# EAGLE design Actuator-VK (EAGLE 9.6.2)

## Sheet 1 of 2: Part Schematics
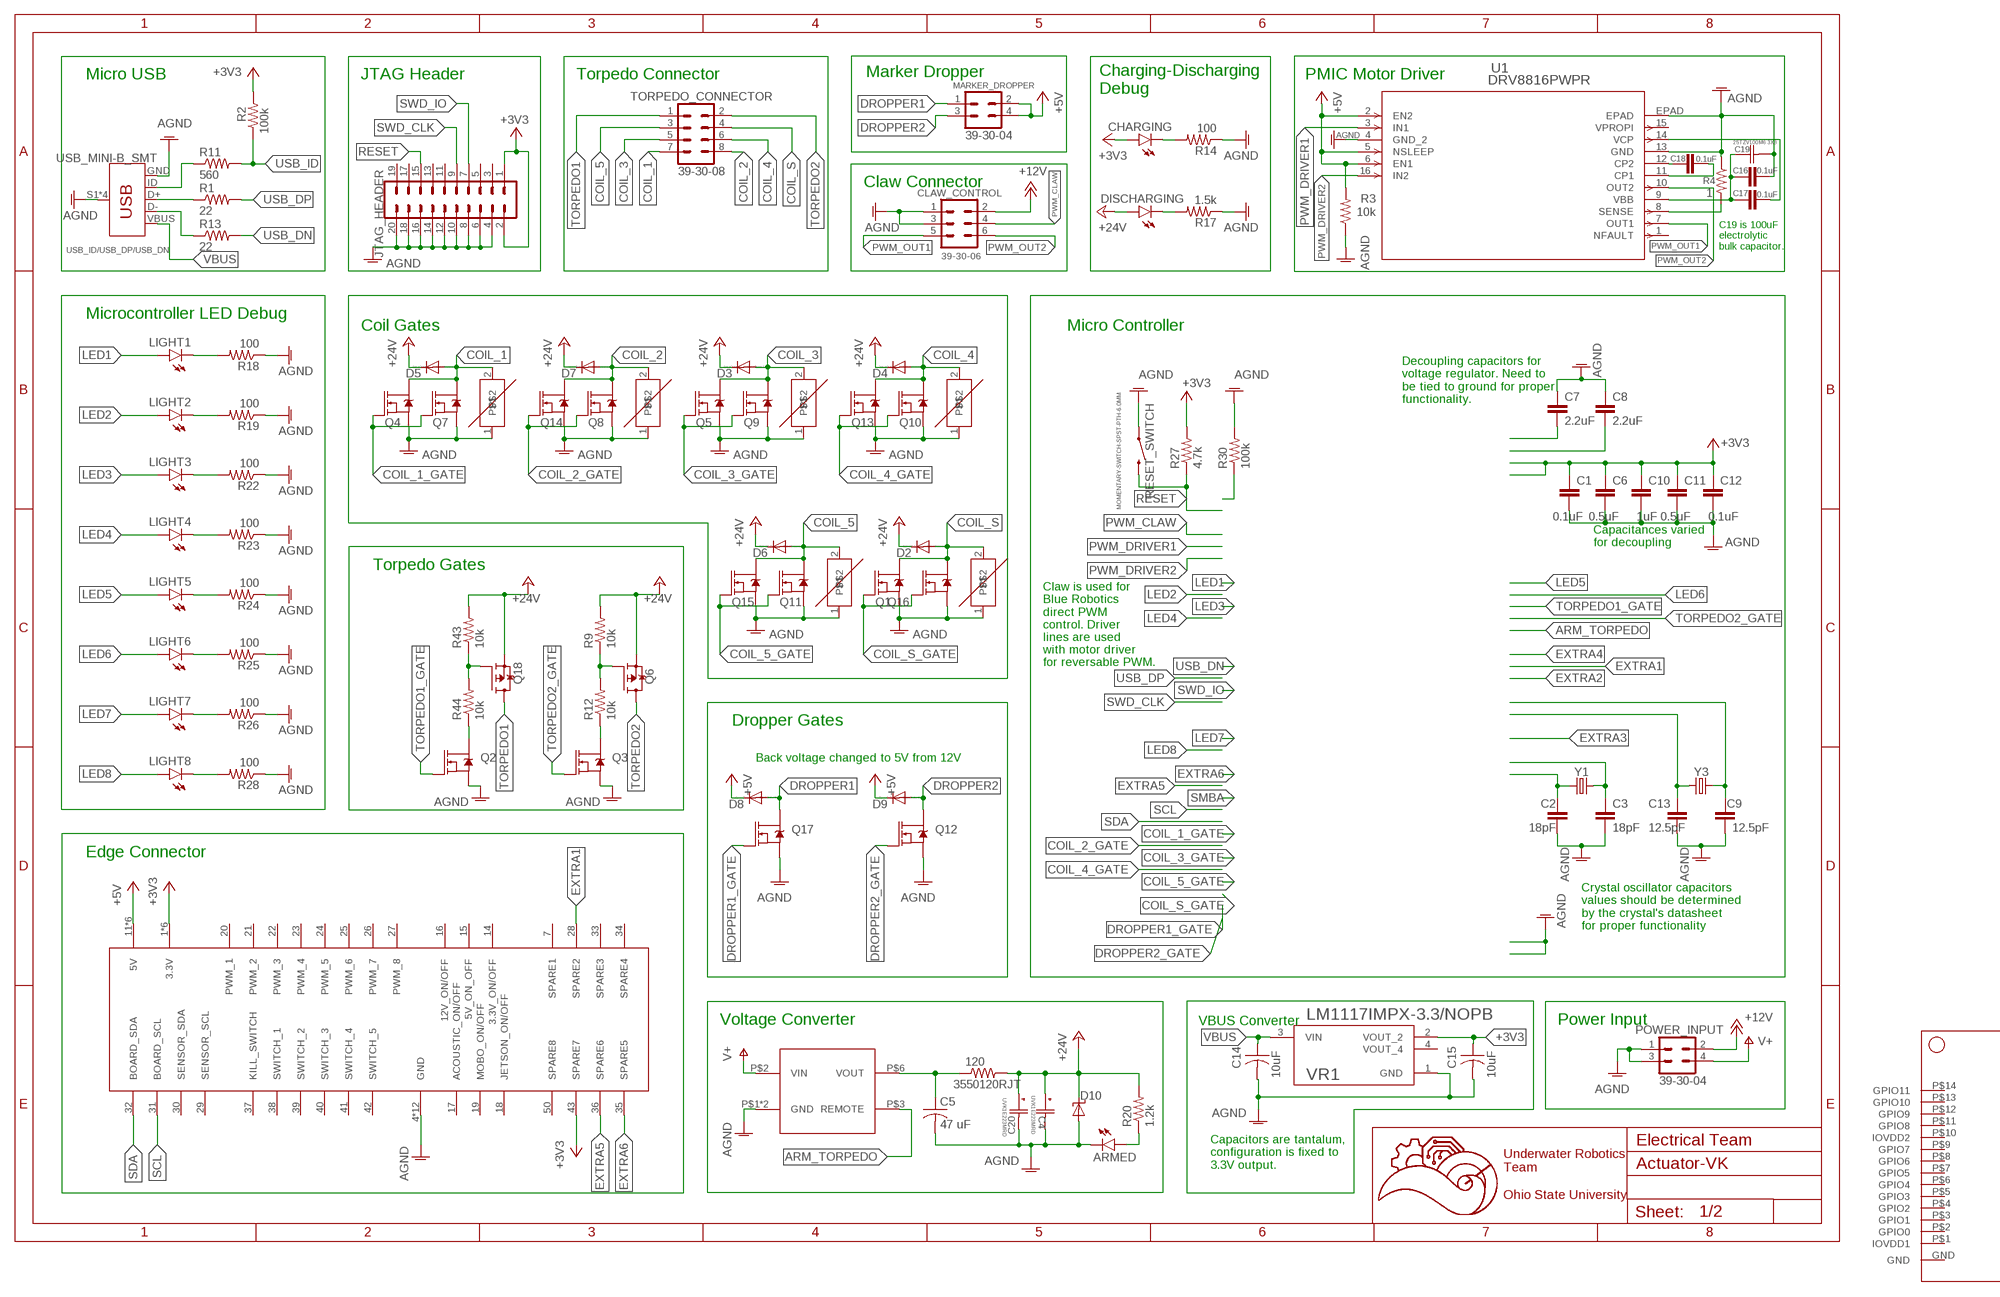
[diagram p0: schematic, sheet 1, part 1 of 2]
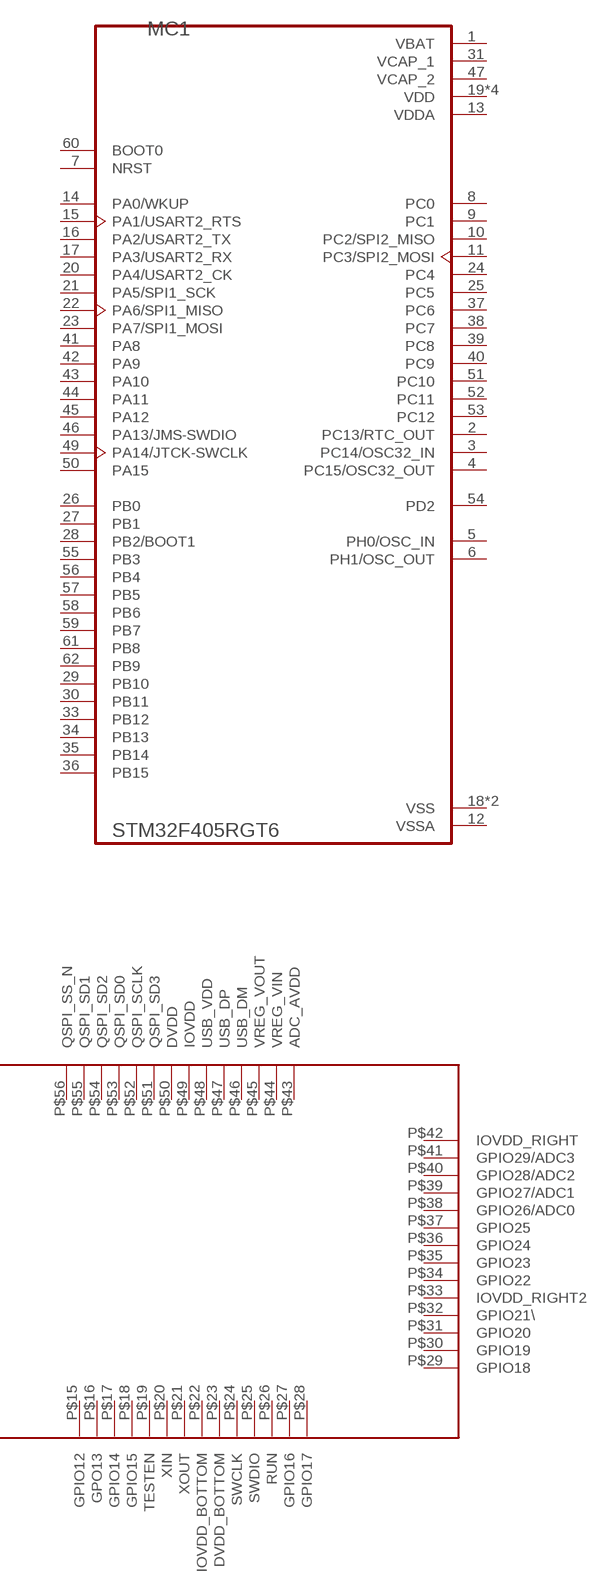
[diagram p1: schematic, sheet 1, part 2 of 2]

### Parts
120  3550120RJT  [3550120RJT]
ARMED  LEDCHIPLED_0603  [CHIPLED_0603]
C1  0.1uF  C-EUC0603  [C0603]
C2  18pF  C-EUC0603  [C0603]
C3  18pF  C-EUC0603  [C0603]
C4  UVK1E223MRD  [CAP_UFW_25X50_NCH]
C5  47 uF  C-USC1206K  [C1206K]
C6  0.5uF  C-EUC0603  [C0603]
C7  2.2uF  C-EUC0603  [C0603]
C8  2.2uF  C-EUC0603  [C0603]
C9  12.5pF  C-EUC0603  [C0603]
C10  1uF  C-EUC0603  [C0603]
C11  0.5uF  C-EUC0603  [C0603]
C12  0.1uF  C-EUC0603  [C0603]
C13  12.5pF  C-EUC0603  [C0603]
C14  10uF  C-USC0603  [C0603]
C15  10uF  C-USC0603  [C0603]
C16  0.1uF  C-EUC0603  [C0603]
C17  0.1uF  C-EUC0603  [C0603]
C18  0.1uF  C-EUC0603  [C0603]
C19  25TZV100M6.3X8  [CAP_J-V_6P3X8_RUB]
C20  UVK1E223MRD  [CAP_UFW_25X50_NCH]
CHARGING  LEDCHIPLED_0603  [CHIPLED_0603]
CLAW_CONTROL  39-30-06  [39-30-?06?]
D2  DIODE-SMB  [SMB]
D3  DIODE-SMB  [SMB]
D4  DIODE-SMB  [SMB]
D5  DIODE-SMB  [SMB]
D6  DIODE-SMB  [SMB]
D7  DIODE-SMB  [SMB]
D8  DIODE-SMB  [SMB]
D9  DIODE-SMB  [SMB]
D10  SUPPRESSOR-SMBJ  [SMBJ]
DISCHARGING  LEDCHIPLED_0603  [CHIPLED_0603]
JTAG_HEADER  CONN_10X2  [2X10]
LIGHT1  LEDCHIPLED_0603  [CHIPLED_0603]
LIGHT2  LEDCHIPLED_0603  [CHIPLED_0603]
LIGHT3  LEDCHIPLED_0603  [CHIPLED_0603]
LIGHT4  LEDCHIPLED_0603  [CHIPLED_0603]
LIGHT5  LEDCHIPLED_0603  [CHIPLED_0603]
LIGHT6  LEDCHIPLED_0603  [CHIPLED_0603]
LIGHT7  LEDCHIPLED_0603  [CHIPLED_0603]
LIGHT8  LEDCHIPLED_0603  [CHIPLED_0603]
MARKER_DROPPER  39-30-04  [39-30-?04?]
MC1  STM32F405RGT6  [QFP50P1200X1200X160-64N]
POWER_INPUT  39-30-04  [39-30-?04?]
Q1  MOSFET-NCH-AO3404A  [SOT23-3]
Q2  MOSFET-NCH-AO3404A  [SOT23-3]
Q3  MOSFET-NCH-AO3404A  [SOT23-3]
Q4  MOSFET-NCH-AO3404A  [SOT23-3]
Q5  MOSFET-NCH-AO3404A  [SOT23-3]
Q6  FDD4141TO252  [TO252]
Q7  MOSFET-NCH-AO3404A  [SOT23-3]
Q8  MOSFET-NCH-AO3404A  [SOT23-3]
Q9  MOSFET-NCH-AO3404A  [SOT23-3]
Q10  MOSFET-NCH-AO3404A  [SOT23-3]
Q11  MOSFET-NCH-AO3404A  [SOT23-3]
Q12  MOSFET-NCH-AO3404A  [SOT23-3]
Q13  MOSFET-NCH-AO3404A  [SOT23-3]
Q14  MOSFET-NCH-AO3404A  [SOT23-3]
Q15  MOSFET-NCH-AO3404A  [SOT23-3]
Q16  MOSFET-NCH-AO3404A  [SOT23-3]
Q17  MOSFET-NCH-AO3404A  [SOT23-3]
Q18  FDD4141TO252  [TO252]
R1  22  R-US_R0603  [R0603]
R2  100k  R-US_R0603  [R0603]
R3  10k  R-US_R0603  [R0603]
R4  1  R-US_R0805  [R0805]
R9  10k  R-US_R0603  [R0603]
R11  560  R-US_R0603  [R0603]
R12  10k  R-US_R0603  [R0603]
R13  22  R-US_R0603  [R0603]
R14  100  R-US_R0805  [R0805]
R17  1.5k  R-US_R0805  [R0805]
R18  100  R-US_R0805  [R0805]
R19  100  R-US_R0805  [R0805]
R20  1.2k  R-US_R0805  [R0805]
R22  100  R-US_R0805  [R0805]
R23  100  R-US_R0805  [R0805]
R24  100  R-US_R0805  [R0805]
R25  100  R-US_R0805  [R0805]
R26  100  R-US_R0805  [R0805]
R27  4.7k  R-US_R0603  [R0603]
R28  100  R-US_R0805  [R0805]
R30  100k  R-US_R0603  [R0603]
R43  10k  R-US_R0603  [R0603]
R44  10k  R-US_R0603  [R0603]
RESET_SWITCH  MOMENTARY-SWITCH-SPST-PTH-6.0MM  [TACTILE_SWITCH_PTH_6.0MM]
TORPEDO_CONNECTOR  39-30-08  [39-30-?08?]
U1  DRV8816PWPR  [PWP_16]
U$1  5530843-EDGE  [5530843-6-BOARDFINGERS]
U$2  ERZ-VF2M270ERZ-VF2M270  [RESM8060X320N]
U$3  ERZ-VF2M270ERZ-VF2M270  [RESM8060X320N]
U$4  ERZ-VF2M270ERZ-VF2M270  [RESM8060X320N]
U$5  ERZ-VF2M270ERZ-VF2M270  [RESM8060X320N]
U$6  TMR6-2415  [TMR6-2415]
U$7  ERZ-VF2M270ERZ-VF2M270  [RESM8060X320N]
U$8  ERZ-VF2M270ERZ-VF2M270  [RESM8060X320N]
U$9  RP2040  [RP2040]
USB_ID/USB_DP/USB_DN  USB_MINI-B_SMT  [USB-MINIB]
VR1  LM1117IMPX-3.3/NOPB  [VREG_LM1117IMPX-3.3/NOPB]
Y1  16MHz  CRYSTAL-16MHZPTH-HC49US  [HC49US]
Y3  32.768kHz  CRYSTAL-32.768KHZSMD-3.2X1.5  [CRYSTAL-SMD-3.2X1.5MM]

### Nets
+3V3: C1.1 C6.1 C10.1 C11.1 C12.1 C15.1 CHARGING.A JTAG_HEADER.1 JTAG_HEADER.2 R2.2 R27.2 U$1.1(3.3V) U$1.2(3.3V) U$1.3(3.3V) U$1.43(SPARE7) U$1.54(3.3V) U$1.55(3.3V) U$1.56(3.3V) VR1.2(VOUT_2)
+5V: D8.C D9.C MARKER_DROPPER.2 MARKER_DROPPER.4 R3.2 U1.2(EN2) U1.5(NSLEEP) U1.6(EN1) U$1.11(5V) U$1.12(5V) U$1.13(5V) U$1.44(5V) U$1.45(5V) U$1.46(5V)
+12V: CLAW_CONTROL.2 POWER_INPUT.2
+24V: 120.P$2 C4.1 C20.1 D2.C D3.C D4.C D5.C D6.C D7.C D10.C DISCHARGING.A Q6.2(S) Q18.2(S) R9.2 R20.2 R43.2
AGND: ARMED.C C1.2 C2.2 C3.2 C4.2 C5.2 C6.2 C7.1 C8.1 C9.2 C10.2 C11.2 C12.2 C13.2 C14.2 C15.2 C16.2 C19.2 C20.2 CLAW_CONTROL.1 CLAW_CONTROL.3 D10.A JTAG_HEADER.4 JTAG_HEADER.6 JTAG_HEADER.8 JTAG_HEADER.10 JTAG_HEADER.12 JTAG_HEADER.14 JTAG_HEADER.16 JTAG_HEADER.18 JTAG_HEADER.20 POWER_INPUT.1 POWER_INPUT.3 Q1.2(S) Q2.2(S) Q3.2(S) Q4.2(S) Q5.2(S) Q7.2(S) Q8.2(S) Q9.2(S) Q10.2(S) Q11.2(S) Q12.2(S) Q13.2(S) Q14.2(S) Q15.2(S) Q16.2(S) Q17.2(S) R3.1 R4.1 R14.1 R17.1 R18.1 R19.1 R22.1 R23.1 R24.1 R25.1 R26.1 R28.1 R30.2 RESET_SWITCH.1 U1.4(GND_2) U1.13(GND) U1.EPAD U$1.4(GND) U$1.5(GND) U$1.6(GND) U$1.8(GND) U$1.9(GND) U$1.10(GND) U$1.47(GND) U$1.48(GND) U$1.49(GND) U$1.51(GND) U$1.52(GND) U$1.53(GND) U$2.1 U$3.1 U$4.1 U$5.1 U$6.P$1(GND) U$6.P$7(GND) U$7.1 U$8.1 USB_ID/USB_DP/USB_DN.GND USB_ID/USB_DP/USB_DN.S1(SHIELD) USB_ID/USB_DP/USB_DN.S2(SHIELD) USB_ID/USB_DP/USB_DN.S3(SHIELD) USB_ID/USB_DP/USB_DN.S4(SHIELD) VR1.1(GND)
ARM_TORPEDO: U$6.P$3(REMOTE)
COIL_1: D5.A Q4.3(D) Q7.3(D) TORPEDO_CONNECTOR.7 U$8.2
COIL_1_GATE: Q4.1(G) Q7.1(G)
COIL_2: D7.A Q8.3(D) Q14.3(D) TORPEDO_CONNECTOR.8 U$7.2
COIL_2_GATE: Q8.1(G) Q14.1(G)
COIL_3: D3.A Q5.3(D) Q9.3(D) TORPEDO_CONNECTOR.5 U$5.2
COIL_3_GATE: Q5.1(G) Q9.1(G)
COIL_4: D4.A Q10.3(D) Q13.3(D) TORPEDO_CONNECTOR.6 U$4.2
COIL_4_GATE: Q10.1(G) Q13.1(G)
COIL_5: D6.A Q11.3(D) Q15.3(D) TORPEDO_CONNECTOR.3 U$3.2
COIL_5_GATE: Q11.1(G) Q15.1(G)
COIL_S: D2.A Q1.3(D) Q16.3(D) TORPEDO_CONNECTOR.4 U$2.2
COIL_S_GATE: Q1.1(G) Q16.1(G)
DROPPER1: D8.A MARKER_DROPPER.1 Q17.3(D)
DROPPER1_GATE: Q17.1(G)
DROPPER2: D9.A MARKER_DROPPER.3 Q12.3(D)
DROPPER2_GATE: Q12.1(G)
EXTRA1: U$1.28(SPARE2)
EXTRA5: U$1.36(SPARE6)
EXTRA6: U$1.35(SPARE5)
LED1: LIGHT1.A
LED2: LIGHT2.A
LED3: LIGHT3.A
LED4: LIGHT4.A
LED5: LIGHT5.A
LED6: LIGHT6.A
LED7: LIGHT7.A
LED8: LIGHT8.A
N$2: C2.1 Y1.1
N$3: C3.1 Y1.2
N$4: CHARGING.C R14.2
N$5: C8.2
N$6: R11.1 USB_ID/USB_DP/USB_DN.ID
N$7: R1.1 USB_ID/USB_DP/USB_DN.D+
N$8: R13.1 USB_ID/USB_DP/USB_DN.D-
N$10: ARMED.A R20.1
N$11: C7.2
N$12: C13.1 Y3.P$2
N$15: DISCHARGING.C R17.2
N$16: LIGHT1.C R18.2
N$17: LIGHT2.C R19.2
N$18: LIGHT3.C R22.2
N$19: LIGHT4.C R23.2
N$21: LIGHT5.C R24.2
N$22: LIGHT6.C R25.2
N$23: LIGHT7.C R26.2
N$24: LIGHT8.C R28.2
N$26: 120.P$1 C5.1 U$6.P$6(VOUT)
N$29: C9.1 Y3.P$1
N$30: R30.1
N$33: Q18.1(G) R43.1 R44.2
N$34: Q2.3(D) R44.1
N$35: Q6.1(G) R9.1 R12.2
N$36: Q3.3(D) R12.1
N$45: R4.2 U1.8(SENSE)
N$46: C17.2 U1.14(VCP)
N$47: C16.1 C17.1 C19.1 U1.9(VBB)
N$48: C18.2 U1.11(CP1)
N$49: C18.1 U1.12(CP2)
PWM_CLAW: CLAW_CONTROL.4
PWM_DRIVER1: U1.3(IN1)
PWM_DRIVER2: U1.16(IN2)
PWM_OUT1: CLAW_CONTROL.5 U1.7(OUT1)
PWM_OUT2: CLAW_CONTROL.6 U1.10(OUT2)
RESET: JTAG_HEADER.15 R27.1 RESET_SWITCH.3
SCL: U$1.31(BOARD_SCL)
SDA: U$1.32(BOARD_SDA)
SWD_CLK: JTAG_HEADER.9
SWD_IO: JTAG_HEADER.7
TORPEDO1: Q18.3(D) TORPEDO_CONNECTOR.1
TORPEDO1_GATE: Q2.1(G)
TORPEDO2: Q6.3(D) TORPEDO_CONNECTOR.2
TORPEDO2_GATE: Q3.1(G)
USB_DN: R13.2
USB_DP: R1.2
USB_ID: R2.1 R11.2
V+: POWER_INPUT.4 U$6.P$2(VIN)
VBUS: C14.1 USB_ID/USB_DP/USB_DN.VBUS VR1.3(VIN)
Unconnected: JTAG_HEADER.3 JTAG_HEADER.5 JTAG_HEADER.11 JTAG_HEADER.13 JTAG_HEADER.17 JTAG_HEADER.19 MC1.2(PC13/RTC_OUT) MC1.3(PC14/OSC32_IN) MC1.4(PC15/OSC32_OUT) MC1.5(PH0/OSC_IN) MC1.6(PH1/OSC_OUT) MC1.7(NRST) MC1.8(PC0) MC1.9(PC1) MC1.10(PC2/SPI2_MISO) MC1.11(PC3/SPI2_MOSI) MC1.14(PA0/WKUP) MC1.15(PA1/USART2_RTS) MC1.16(PA2/USART2_TX) MC1.17(PA3/USART2_RX) MC1.20(PA4/USART2_CK) MC1.21(PA5/SPI1_SCK) MC1.22(PA6/SPI1_MISO) MC1.23(PA7/SPI1_MOSI) MC1.24(PC4) MC1.25(PC5) MC1.26(PB0) MC1.27(PB1) MC1.28(PB2/BOOT1) MC1.29(PB10) MC1.30(PB11) MC1.33(PB12) MC1.34(PB13) MC1.35(PB14) MC1.36(PB15) MC1.37(PC6) MC1.38(PC7) MC1.39(PC8) MC1.40(PC9) MC1.41(PA8) MC1.42(PA9) MC1.43(PA10) MC1.44(PA11) MC1.45(PA12) MC1.46(PA13/JMS-SWDIO) MC1.49(PA14/JTCK-SWCLK) MC1.50(PA15) MC1.51(PC10) MC1.52(PC11) MC1.53(PC12) MC1.54(PD2) MC1.55(PB3) MC1.56(PB4) MC1.57(PB5) MC1.58(PB6) MC1.59(PB7) MC1.60(BOOT0) MC1.61(PB8) MC1.62(PB9) U1.1(NFAULT) U1.15(VPROPI) U$1.7(SPARE1) U$1.14(3.3V_ON/OFF) U$1.15(5V_ON_OFF) U$1.16(12V_ON/OFF) U$1.17(ACOUSTIC_ON/OFF) U$1.18(JETSON_ON/OFF) U$1.19(MOBO_ON/OFF) U$1.20(PWM_1) U$1.21(PWM_2) U$1.22(PWM_3) U$1.23(PWM_4) U$1.24(PWM_5) U$1.25(PWM_6) U$1.26(PWM_7) U$1.27(PWM_8) U$1.29(SENSOR_SCL) U$1.30(SENSOR_SDA) U$1.33(SPARE3) U$1.34(SPARE4) U$1.37(KILL_SWITCH) U$1.38(SWITCH_1) U$1.39(SWITCH_2) U$1.40(SWITCH_3) U$1.41(SWITCH_4) U$1.42(SWITCH_5) U$1.50(SPARE8) U$9.GND U$9.P$1(IOVDD1) U$9.P$2(GPIO0) U$9.P$3(GPIO1) U$9.P$4(GPIO2) U$9.P$5(GPIO3) U$9.P$6(GPIO4) U$9.P$7(GPIO5) U$9.P$8(GPIO6) U$9.P$9(GPIO7) U$9.P$10(IOVDD2) U$9.P$11(GPIO8) U$9.P$12(GPIO9) U$9.P$13(GPIO10) U$9.P$14(GPIO11) U$9.P$15(GPIO12) U$9.P$16(GPO13) U$9.P$17(GPIO14) U$9.P$18(GPIO15) U$9.P$19(TESTEN) U$9.P$20(XIN) U$9.P$21(XOUT) U$9.P$22(IOVDD_BOTTOM) U$9.P$23(DVDD_BOTTOM) U$9.P$24(SWCLK) U$9.P$25(SWDIO) U$9.P$26(RUN) U$9.P$27(GPIO16) U$9.P$28(GPIO17) U$9.P$29(GPIO18) U$9.P$30(GPIO19) U$9.P$31(GPIO20) U$9.P$32(GPIO21\) U$9.P$33(IOVDD_RIGHT2) U$9.P$34(GPIO22) U$9.P$35(GPIO23) U$9.P$36(GPIO24) U$9.P$37(GPIO25) U$9.P$38(GPIO26/ADC0) U$9.P$39(GPIO27/ADC1) U$9.P$40(GPIO28/ADC2) U$9.P$41(GPIO29/ADC3) U$9.P$42(IOVDD_RIGHT) U$9.P$43(ADC_AVDD) U$9.P$44(VREG_VIN) U$9.P$45(VREG_VOUT) U$9.P$46(USB_DM) U$9.P$47(USB_DP) U$9.P$48(USB_VDD) U$9.P$49(IOVDD) U$9.P$50(DVDD) U$9.P$51(QSPI_SD3) U$9.P$52(QSPI_SCLK) U$9.P$53(QSPI_SD0) U$9.P$54(QSPI_SD2) U$9.P$55(QSPI_SD1) U$9.P$56(QSPI_SS_N) VR1.4(VOUT_4)

### Notes on the sheet
- Micro USB | JTAG Header | Torpedo Connector | Marker Dropper | PMIC Motor Driver
- Charging-Discharging 
  Debug
- Claw Connector
- C19 is 100uF
  electrolytic
  bulk capacitor.
- Microcontroller LED Debug
- Coil Gates | Micro Controller
- Decoupling capacitors for 
  voltage regulator. Need to
  be tied to ground for proper
  functionality.
- Capacitances varied 
  for decoupling
- Torpedo Gates
- Claw is used for
  Blue Robotics
  direct PWM
  control. Driver
  lines are used
  with motor driver
  for reversable PWM.
- Dropper Gates
- Back voltage changed to 5V from 12V
- Edge Connector
- Crystal oscillator capacitors
  values should be determined
  by the crystal's datasheet
  for proper functionality
- Voltage Converter | VBUS Converter | Power Input
- Electrical Team
- Capacitors are tantalum, 
  configuration is fixed to 
  3.3V output.
- Underwater Robotics
  Team
  
  Ohio State University

## Sheet 2 of 2: Notes
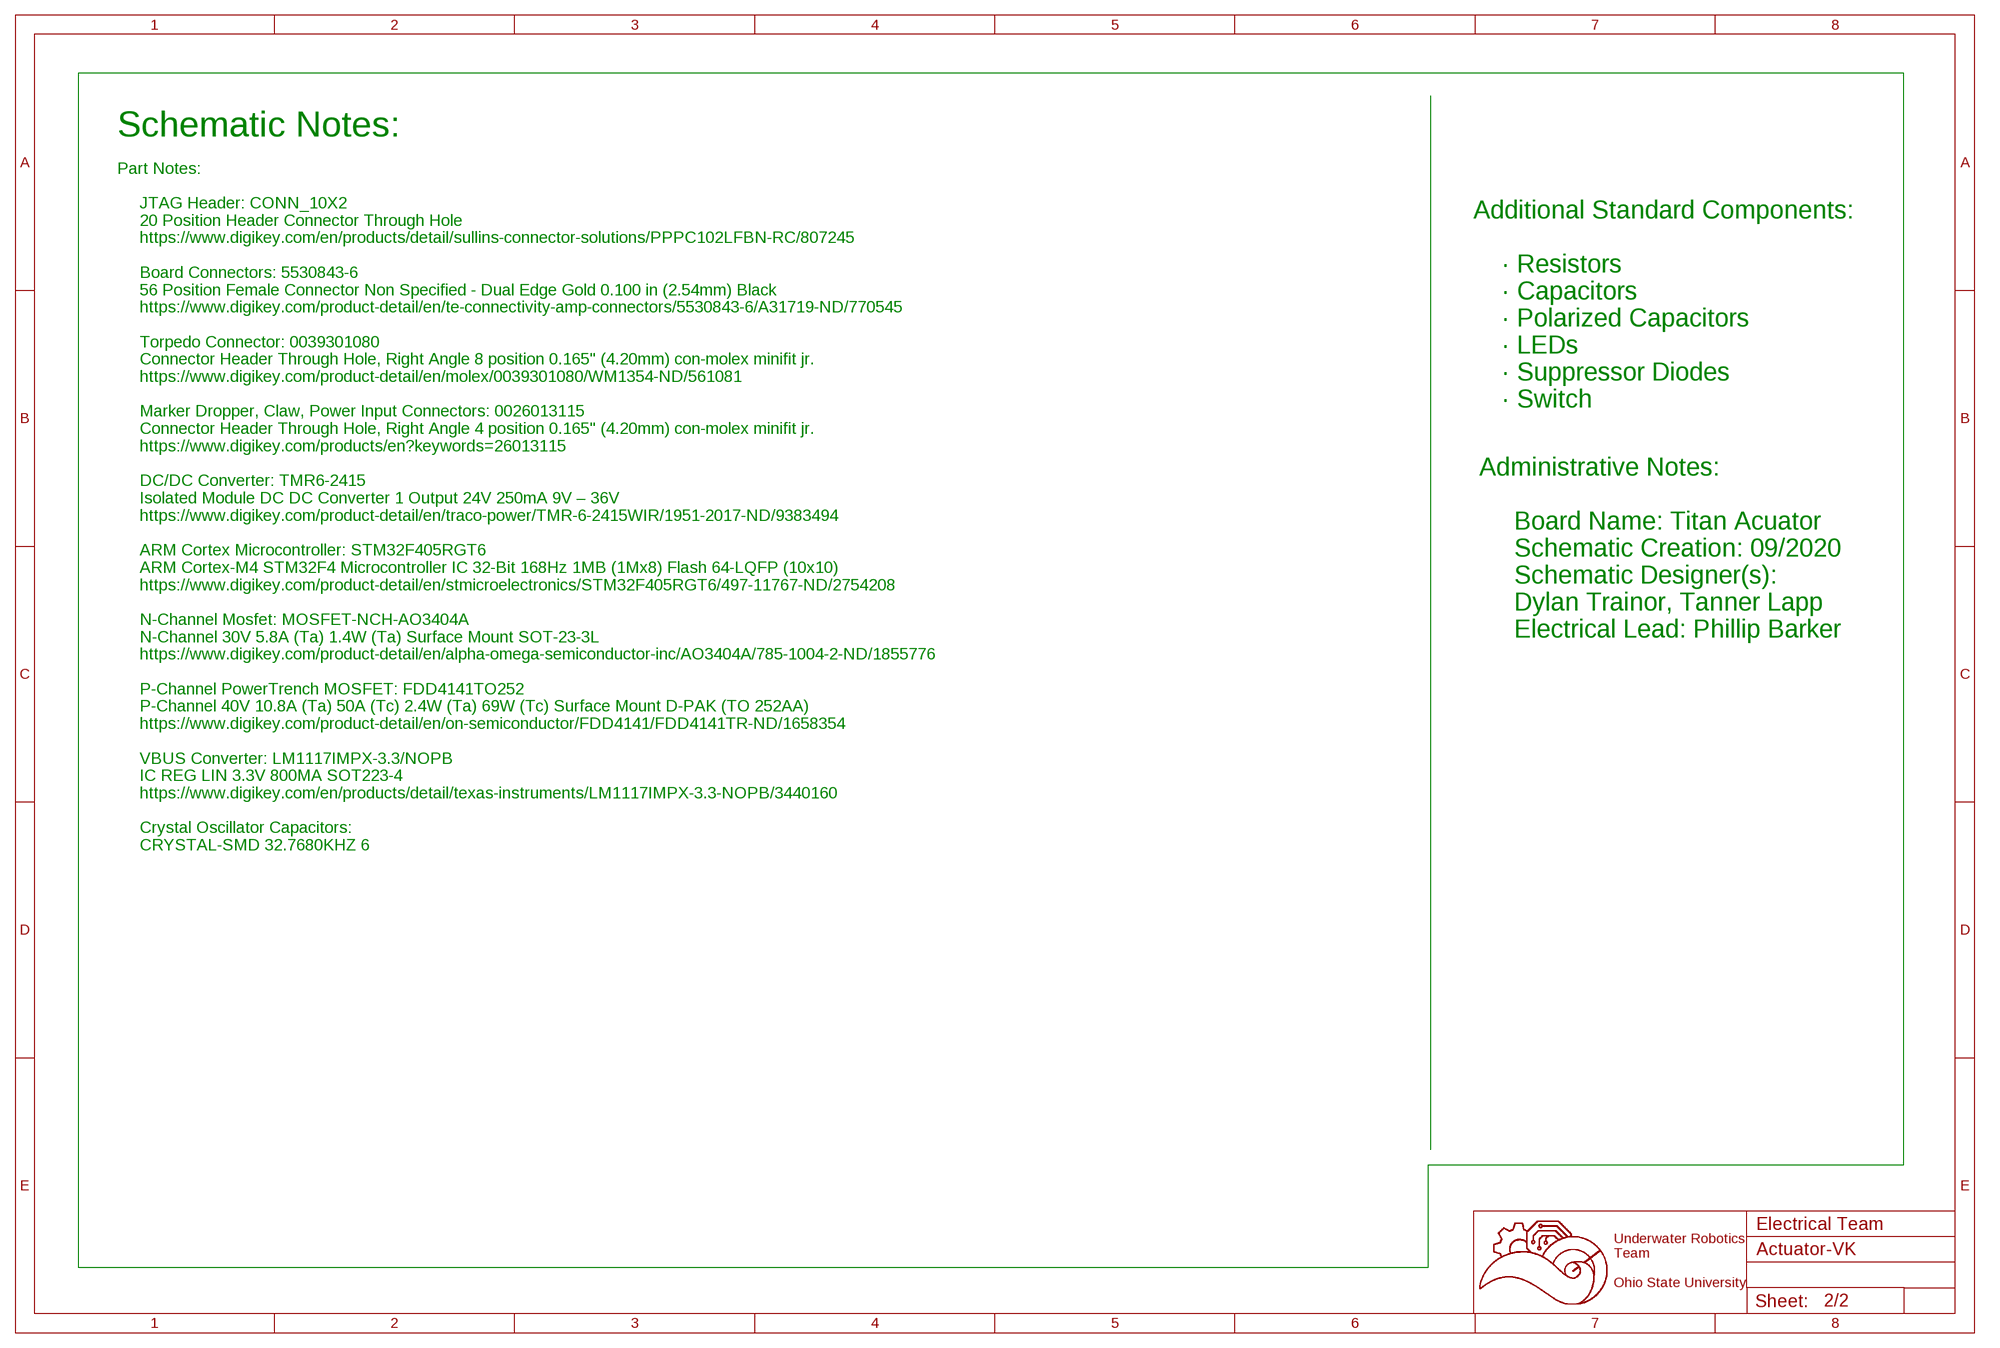
[diagram p2: schematic, sheet 2]

### Notes on the sheet
- Schematic Notes:
- Part Notes:
  
       JTAG Header: CONN_10X2
       20 Position Header Connector Through Hole 
       https://www.digikey.com/en/products/detail/sullins-connector-solutions/PPPC102LFBN-RC/807245
    
       Board Connectors: 5530843-6 
       56 Position Female Connector Non Specified - Dual Edge Gold 0.100 in (2.54mm) Black 
       https://www.digikey.com/product-detail/en/te-connectivity-amp-connectors/5530843-6/A31719-ND/770545 
    
       Torpedo Connector: 0039301080 
       Connector Header Through Hole, Right Angle 8 position 0.165" (4.20mm) con-molex minifit jr. 
       https://www.digikey.com/product-detail/en/molex/0039301080/WM1354-ND/561081 
    
       Marker Dropper, Claw, Power Input Connectors: 0026013115 
       Connector Header Through Hole, Right Angle 4 position 0.165" (4.20mm) con-molex minifit jr. 
       https://www.digikey.com/products/en?keywords=26013115 
    
       DC/DC Converter: TMR6-2415 
       Isolated Module DC DC Converter 1 Output 24V 250mA 9V – 36V 
       https://www.digikey.com/product-detail/en/traco-power/TMR-6-2415WIR/1951-2017-ND/9383494 
    
       ARM Cortex Microcontroller: STM32F405RGT6 
       ARM Cortex-M4 STM32F4 Microcontroller IC 32-Bit 168Hz 1MB (1Mx8) Flash 64-LQFP (10x10) 
       https://www.digikey.com/product-detail/en/stmicroelectronics/STM32F405RGT6/497-11767-ND/2754208 
    
       N-Channel Mosfet: MOSFET-NCH-AO3404A 
       N-Channel 30V 5.8A (Ta) 1.4W (Ta) Surface Mount SOT-23-3L 
       https://www.digikey.com/product-detail/en/alpha-omega-semiconductor-inc/AO3404A/785-1004-2-ND/1855776 
    
       P-Channel PowerTrench MOSFET: FDD4141TO252 
       P-Channel 40V 10.8A (Ta) 50A (Tc) 2.4W (Ta) 69W (Tc) Surface Mount D-PAK (TO 252AA) 
       https://www.digikey.com/product-detail/en/on-semiconductor/FDD4141/FDD4141TR-ND/1658354
  
       VBUS Converter: LM1117IMPX-3.3/NOPB
       IC REG LIN 3.3V 800MA SOT223-4
       https://www.digikey.com/en/products/detail/texas-instruments/LM1117IMPX-3.3-NOPB/3440160
    
       Crystal Oscillator Capacitors: 
       CRYSTAL-SMD 32.7680KHZ 6PF  3.2X1.5MM 
       https://www.digikey.com/en/products/detail/micro-crystal-ag/CM7V-T1A-32-768KHZ-6PF-20PPM-TA-QC/10499118
       CRYSTAL-16MHZPTH-HC49US (CRYSTAL-16MHZ)
       https://www.digikey.com/en/products/detail/abracon-llc/ABM3B-16-000MHZ-B2-T/675317?s=N4IgTCBcDaIKwGY4FoCcBGMZnuQOQBEQBdAXyA 
  
       ERZ-VF2M270 Varistor
       VARISTOR 27V 125A 2SMD JLEAD
       https://www.digikey.com/en/products/detail/panasonic-electronic-components/ERZ-VF2M270/672899
  
       3550120RJT Resistor
       RES 3550 120 Ohm 5% 5W
       https://www.digikey.com/en/products/detail/te-connectivity-passive-product/3550120RJT/9927251
  
       DRV8816PWPR Motor Driver
       IC MOTOR DRIVER 8V-38V 16HTSSOP
       https://www.digikey.com/en/products/detail/texas-instruments/DRV8816PWPR/4439658
  
       25TZV100M6.3X8 Electrolytic Capacitor
       CAP ALUM 100UF 20% 25V SMD
       https://www.digikey.com/en/products/detail/rubycon/25TZV100M6-3X8/3134865
  
       UVK1E223MRD 22mF Capacitor
       CAP ALUM 22000UF 20% 25V RADIAL
       https://www.digikey.com/en/products/detail/nichicon/UVK1E223MRD/2539394
- Additional Standard Components:
  
       · Resistors 
       · Capacitors 
       · Polarized Capacitors 
       · LEDs 
       · Suppressor Diodes 
       · Switch
- Administrative Notes:
  
       Board Name: Titan Acuator
       Schematic Creation: 09/2020
       Schematic Designer(s): 
       Dylan Trainor, Tanner Lapp
       Electrical Lead: Phillip Barker
- Electrical Team
- Underwater Robotics
  Team
  
  Ohio State University

## Power pins joined to a net without a drawn wire
VBAT: MC1.1(VBAT)
VCAP_1: MC1.31(VCAP_1)
VCAP_2: MC1.47(VCAP_2)
VDD: MC1.19(VDD) MC1.32(VDD) MC1.48(VDD) MC1.64(VDD)
VDDA: MC1.13(VDDA)
VSS: MC1.18(VSS) MC1.63(VSS)
VSSA: MC1.12(VSSA)

## Library data of the parts
120 = 3550120RJT:3550120RJT
ARMED CHARGING DISCHARGING LIGHT1-LIGHT8 = led:LED: LED OSRAM: - CHIPLED LG R971, LG N971, LY N971, LG Q971, LY Q971, LO R971, LY R971 LH N974, LH R974 LS Q976, LO Q976, LY Q976 LO Q996 - Hyper CHIPLED LW Q18S LB Q993, LB Q99A, LB R99A - SideLED LS A670, LO A670, LY A670, LG A670, LP A670 LB A673, LV A673, LT A673, LW A673 LH A674 LY A675 LS A676, LA A676, LO A676, LY A676, LW A676 LS A679, LY A679, LG A679 - Hyper Micro SIDELED® LS Y876, LA Y876, LO Y876, LY Y876 LT Y87S - SmartLED LW L88C, LW L88S LB L89C, LB L89S, LG L890 LS L89K, LO L89K, LY L89K LS L896, LA L896, LO L896, LY L896 - TOPLED LS T670, LO T670, LY T670, LG T670, LP T670 LSG T670, LSP T670, LSY T670, LOP T670, LYG T670 LG T671, LOG T671, LSG T671 LB T673, LV T673, LT T673, LW T673 LH T674 LS T676, LA T676, LO T676, LY T676, LB T676, LH T676, LSB T676, LW T676 LB T67C, LV T67C, LT T67C, LS T67K, LO T67K, LY T67K, LW E67C LS E67B, LA E67B, LO E67B, LY E67B, LB E67C, LV E67C, LT E67C LW T67C LS T679, LY T679, LG T679 LS T770, LO T770, LY T770, LG T770, LP T770 LB T773, LV T773, LT T773, LW T773 LH T774 LS E675, LA E675, LY E675, LS T675 LS T776, LA T776, LO T776, LY T776, LB T776 LHGB T686 LT T68C, LB T68C - Hyper Mini TOPLED® LB M676 - Mini TOPLED Santana® LG M470 LS M47K, LO M47K, LY M47K Source: http://www.osram.convergy.de LUXEON: - LUMILED® LXK2-PW12-R00, LXK2-PW12-S00, LXK2-PW14-U00, LXK2-PW14-V00 LXK2-PM12-R00, LXK2-PM12-S00, LXK2-PM14-U00 LXK2-PE12-Q00, LXK2-PE12-R00, LXK2-PE12-S00, LXK2-PE14-T00, LXK2-PE14-U00 LXK2-PB12-K00, LXK2-PB12-L00, LXK2-PB12-M00, LXK2-PB14-N00, LXK2-PB14-P00, LXK2-PB14-Q00 LXK2-PR12-L00, LXK2-PR12-M00, LXK2-PR14-Q00, LXK2-PR14-R00 LXK2-PD12-Q00, LXK2-PD12-R00, LXK2-PD12-S00 LXK2-PH12-R00, LXK2-PH12-S00 LXK2-PL12-P00, LXK2-PL12-Q00, LXK2-PL12-R00 Source: www.luxeon.com KINGBRIGHT: KA-3528ASYC Source: www.kingbright.com
C1-C3 C6-C13 C16-C18 = rcl:C-EU: CAPACITOR, European symbol; SPICEPREFIX: C
C4 C20 = UVK1E223MRD:UVK1E223MRD; BUILT_BY: EMA_Cory; COPYRIGHT: Copyright (C) 2018 Accelerated Designs. All rights reserved; MANUFACTURER_PART_NUMBER: UVK1E223MRD; SOURCELIBRARY: Nichicon_2019-09-13; VENDOR: Nichicon
C5 = resistor:C-US: CAPACITOR, American symbol
C14 C15 = rcl:C-US: CAPACITOR, American symbol; SPICEPREFIX: C
C19 = 25TZV100M6_3X8:25TZV100M6.3X8; BUILT_BY: EMA_Cory; COPYRIGHT: Copyright (C) 2018 Accelerated Designs. All rights reserved; MANUFACTURER_PART_NUMBER: 25TZV100M6.3X8; SOURCELIBRARY: Rubycon_2019-09-19; VENDOR: Rubycon Netherlands
CLAW_CONTROL = con-molex-mini-fit:39-30-?06?: HEADER
D2-D9 = diode:DIODE-: DIODE
D10 = diode:SUPPRESSOR-: Suppressor diode
JTAG_HEADER = SparkFun-Connectors:CONN_10X2: Multi connection point. Often used as Generic Header-pin footprint for 0.1 inch spaced/style header connections On any of the 0.1 inch spaced packages, you can populate with these: Break Away Headers - Straight <https://www.sparkfun.com/products/116> (PRT-00116) Break Away Male Headers - Right Angle <https://www.sparkfun.com/products/553> (PRT-00553) Female Headers <https://www.sparkfun.com/products/115> (PRT-00115) Break Away Headers - Machine Pin <https://www.sparkfun.com/products/117> (PRT-00117) Break Away Female Headers - Swiss Machine Pin <https://www.sparkfun.com/products/743> (PRT-00743) Special note about the "SPECIAL" package: This was SPECIALLY designed to be used with our Graphic LCD Backpack. Be sure you want to use this! It is not only staggered on each line of header holes, but IT IS ALSO offset of the center point of the top and bottom lines by 5 mil. This causes the headers to lock into place on the "standard" footprint on the LCD screen. The extra squares on the tdocu layer are there simply to reference other pins (if you were to actually populate a longer header than ten long - this is what we do with the backpacks).
MARKER_DROPPER POWER_INPUT = con-molex-mini-fit:39-30-?04?: HEADER
MC1 = STM32F405RGT6:STM32F405RGT6: High-performance foundation line, ARM Cortex-M4 core with DSP and FPU, 1 Mbyte Flash, 168 MHz CPU, ART Accelerator; AVAILABILITY: Unavailable; DESCRIPTION: High-performance foundation line, ARM Cortex-M4 core with DSP and FPU, 1 Mbyte Flash, 168 MHz CPU, ART Accelerator; MF: STMicroelectronics; MP: STM32F405RGT6; PACKAGE: LQFP-64 STMicroelectronics; PRICE: None
Q1-Q5 Q7-Q17 = SparkFun-DiscreteSemi:MOSFET-NCH: N-channel MOSFETs Voltage controlled devices that allow control of high current outputs. SparkFun Products: SparkFun OpenScale <https://www.sparkfun.com/products/13261> SparkFun Digital Sandbox <https://www.sparkfun.com/products/12651> SparkFun Monster Moto Shield <https://www.sparkfun.com/products/10182> SparkFun MOSFET Power Controller <https://www.sparkfun.com/products/11214>; PROD_ID: TRANS-12988; VALUE: 5.8A/30V/35mΩ
Q6 Q18 = transistor-fet:FDD4141: P-Channel PowerTrench® MOSFET Source: FDD4141.pdf
R1 R2 R11 R13 R27 R30 = rcl:R-US_: RESISTOR, American symbol; SPICEPREFIX: R
R3 R4 R9 R12 R14 R17-R20 R22-R26 R28 R43 R44 = resistor:R-US_: RESISTOR, American symbol
RESET_SWITCH = SparkFun-Switches:MOMENTARY-SWITCH-SPST: Momentary Switch (Pushbutton) - SPST Normally-open (NO) SPST momentary switches (buttons, pushbuttons). Variants PTH-12MM - 12mm square, through-hole Momentary Pushbutton Switch - 12mm Square <https://www.sparkfun.com/products/9190> (COM-09190) PTH-6.0MM, PTH-6.0MM-KIT - 6.0mm square, through-hole Mini Pushbutton Switch <https://www.sparkfun.com/products/97> (COM-00097) KIT package intended for soldering kit's - only one side of pads' copper is exposed. PTH-RIGHT-ANGLE-KIT - Right-angle, through-hole Right Angle Tactile Button <https://www.sparkfun.com/products/10791> - Used on SparkFun BigTime Watch Kit <https://www.sparkfun.com/products/11734> SMD-12MM - 12mm square, surface-mount Tactile Button - SMD (12mm) <https://www.sparkfun.com/products/12993> (COM-12993) Used on SparkFun PicoBoard <https://www.sparkfun.com/products/11888> SMD-4.5MM - 4.5mm Square Trackball Switch Used on SparkFun Blackberry Trackballer Breakout <https://www.sparkfun.com/products/13169> SMD-4.6MMX2.8MM - 4.60mm x 2.80mm, surface mount Used on SparkFun SAMD21 Mini Breakout <https://www.sparkfun.com/products/13664> SMD-5.2MM, SMD-5.2-REDUNDANT - 5.2mm square, surface-mount Mini Pushbutton Switch - SMD <https://www.sparkfun.com/products/8720> (COM-08720) Used on Arduino Pro Mini <https://www.sparkfun.com/products/11114> REDUNDANT package connects both switch circuits together SMD-6.0X3.5MM - 6.0 x 3.5mm, surface mount Momentary Reset Switch SMD <https://www.sparkfun.com/products/8229> (COM-08229) SMD-6.2MM-TALL - 6.2mm square, surface mount Tactile Button - SMD (6mm) <https://www.sparkfun.com/products/12992> Used on SparkFun Digital Sandbox <https://www.sparkfun.com/products/12651> SMD-RIGHT-ANGLE - Right-angle, surface mount Used on SparkFun Block for Intel® Edison - Arduino <https://www.sparkfun.com/products/13036>; PROD_ID: SWCH-08441; SF_SKU: COM-00097
TORPEDO_CONNECTOR = con-molex-mini-fit:39-30-?08?: HEADER
U1 = DRV8816POWPR:DRV8816PWPR; MANUFACTURER_PART_NUMBER: DRV8816PWPR; VENDOR: Texas Instruments
U$1 = 5530843-6:5530843-EDGE
U$2-U$5 U$7 U$8 = ERZ-VF2M270:ERZ-VF2M270
U$6 = converter:TMR6-2415
U$9 = rp2040:RP2040
USB_ID/USB_DP/USB_DN = SparkFun-Connectors:USB_MINI-B: USB type Mini-B Connector Breaks out 5th pin, and includes shield pins if needed. SparkFun Products: SparkFun FTDI Basic Breakout <https://www.sparkfun.com/products/9716> SparkFun XBee Explorer USB <https://www.sparkfun.com/products/11812> SparkFun Redboard <https://www.sparkfun.com/products/12757>; PROD_ID: CONN-08193; SF_ID: PRT-00587
VR1 = LM1117IMPX-3.3_NOPB:LM1117IMPX-3.3/NOPB: 800-mA 15-V linear voltage regulator 4-SOT-223 0 to 125 Check prices <https://pricing.snapeda.com/parts/LM1117IMPX-3.3/NOPB/Texas%20Instruments/view-part?ref=eda>; AVAILABILITY: Good; DESCRIPTION: 800-mA 15-V linear voltage regulator 4-SOT-223 -40 to 125; MF: Texas Instruments; MP: LM1117IMPX-3.3/NOPB; PACKAGE: SOT-223-4 Texas Instruments; PRICE: None; PURCHASE-URL: https://pricing.snapeda.com/search/part/LM1117IMPX-3.3/NOPB/?ref=eda
Y1 = SparkFun-Clocks:CRYSTAL-16MHZ: 16MHz Crystal Digikey Example <http://www.digikey.com/product-search/en?keywords=535-9122-1-ND> Frequency: 16MHz Frequency Stability: ±50ppm Frequency Tolerance: ±20ppm Load Capacitance: 18pF SparkFun Products: Pro Micro -5V/16MHz <https://www.sparkfun.com/products/12640> SparkFun Serial Enabled LCD Kit <https://www.sparkfun.com/products/10097>; PROD_ID: XTAL-08181; SF_ID: COM-00536
Y3 = SparkFun-Clocks:CRYSTAL-32.768KHZ: 32.768kHz Crystal Frequency: 32.768kHz Frequency Stability: ±20ppm Load Capacitance: 12.5pF (PTH-2X6 & SMD-3.2X1.5), 6pF (SMD-2X6) SparkFun Products: SparkFun BigTime Watch Kit <https://www.sparkfun.com/products/11734> SparkFun nRF52832 Breakout <https://www.sparkfun.com/products/13990> SparkFun Real Time Clock Module <https://www.sparkfun.com/products/12708>; PROD_ID: XTAL-13062

## Board
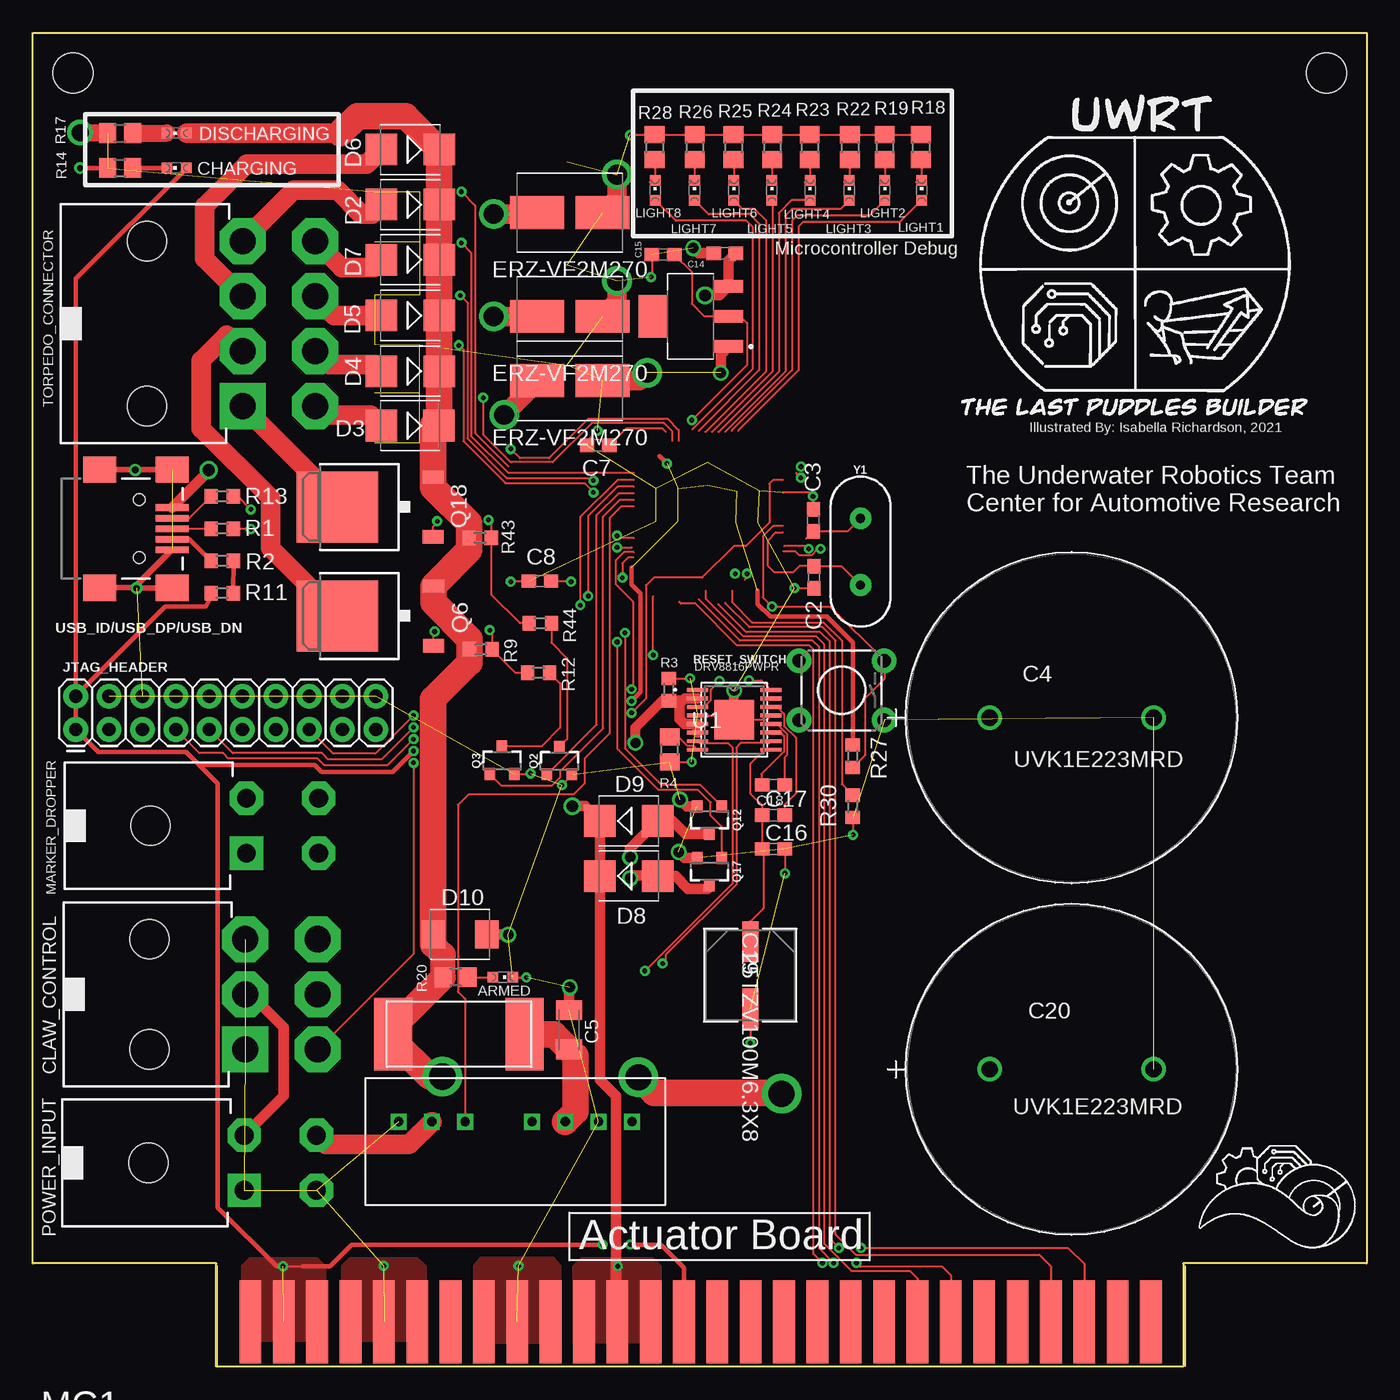
[diagram p3: board, top side]
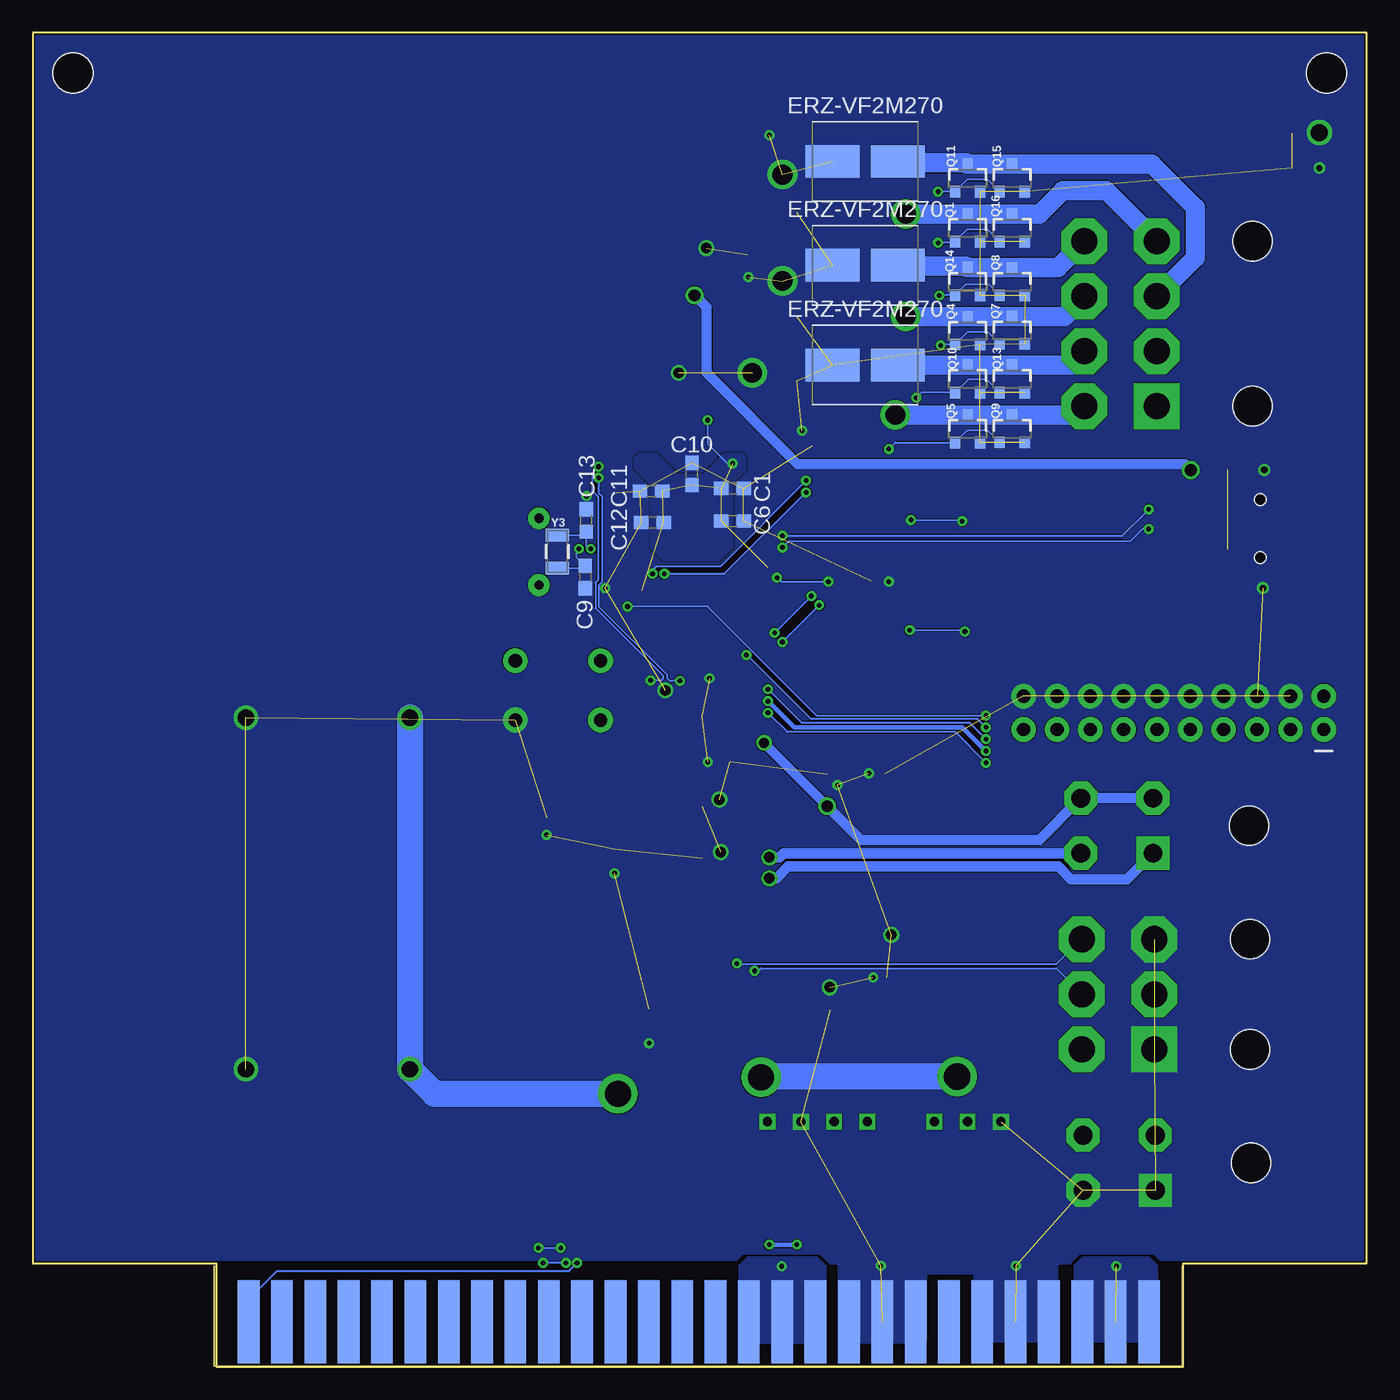
[diagram p4: board, bottom side, seen from below]

Size 101.6 x 101.6 mm. Coordinates in mm from the lower left corner, seen from the top.
Outline: 13.97,0 13.97,7.87 0,7.87 0,101.6 101.6,101.6 101.6,7.87 87.63,7.87 87.63,0 13.97,0
Copper layers (1*16): Top 0.035mm / dielectric 1.5mm / Bottom 0.035mm
Design rules "default *": minimum track width 6mil, minimum drill 0.35mm, track to track 2mil, track to pad 2mil, pad to pad 2mil, via to via 2mil, smd to smd 2mil, copper to edge 0mil, drill to drill 6mil, minimum pad ring 10mil, minimum via ring 8mil, stop-mask expansion 4mil, vias tented up to drill 0mil, thermal gap 10mil
Holes 3.05 mm at 3.05,98.55 98.55,98.55

### Footprints (pad centres in the part's own frame; a part is rotated, then mirrored left to right if it is on the bottom)
3550120RJT = smd 2.896 x 5.499: P$1 -5,0; P$2 5,0
CHIPLED_0603 = smd 0.8 x 0.8: A 0,-0.75; C 0,0.75
C0603 = smd 1.1 x 1: 1 -0.85,0; 2 0.85,0
CAP_UFW_25X50_NCH = drill 1.245 pad 1.753: 1 0,0; 2 12.497,0
C1206K = smd 1.5 x 2: 1 -1.5,0; 2 1.5,0
CAP_J-V_6P3X8_RUB = smd 3.099 x 1.219: 1 -2.553,0; 2 2.553,0
39-30-?06? = drill 2 pad 3.5 square: 1 4.191,0 | drill 2 pad 3.5 octagon: 2 0,0; 3 -4.191,0; 4 4.191,5.512; 5 0,5.512; 6 -4.191,5.512 | hole 3: -4.191,-7.3; 4.191,-7.3
SMB = smd 2.4 x 2.4: A 2.2,0; C -2.2,0
SMBJ = smd 1.78 x 2.16: A 2.04,0; C -2.03,0
2X10 = drill 1.016 pad 1.88: 1 0,0; 2 0,2.54; 3 2.54,0; 4 2.54,2.54; 5 5.08,0; 6 5.08,2.54; 7 7.62,0; 8 7.62,2.54; 9 10.16,0; 10 10.16,2.54; 11 12.7,0; 12 12.7,2.54; 13 15.24,0; 14 15.24,2.54; 15 17.78,0; 16 17.78,2.54; 17 20.32,0; 18 20.32,2.54; 19 22.86,0; 20 22.86,2.54
39-30-?04? = drill 1.422 pad 2.54 square: 1 2.095,0 | drill 1.422 pad 2.54 octagon: 2 -2.095,0; 3 2.095,5.512; 4 -2.095,5.512 | hole 3: 0,-7.3
QFP50P1200X1200X160-64N = smd 1.47 x 0.28: 1 -5.67,3.75; 2 -5.67,3.25; 3 -5.67,2.75; 4 -5.67,2.25; 5 -5.67,1.75; 6 -5.67,1.25; 7 -5.67,0.75; 8 -5.67,0.25; 9 -5.67,-0.25; 10 -5.67,-0.75; 11 -5.67,-1.25; 12 -5.67,-1.75; 13 -5.67,-2.25; 14 -5.67,-2.75; 15 -5.67,-3.25; 16 -5.67,-3.75; 33 5.67,-3.75; 34 5.67,-3.25; 35 5.67,-2.75; 36 5.67,-2.25; 37 5.67,-1.75; 38 5.67,-1.25; 39 5.67,-0.75; 40 5.67,-0.25; 41 5.67,0.25; 42 5.67,0.75; 43 5.67,1.25; 44 5.67,1.75; 45 5.67,2.25; 46 5.67,2.75; 47 5.67,3.25; 48 5.67,3.75 | smd 0.28 x 1.47: 17 -3.75,-5.67; 18 -3.25,-5.67; 19 -2.75,-5.67; 20 -2.25,-5.67; 21 -1.75,-5.67; 22 -1.25,-5.67; 23 -0.75,-5.67; 24 -0.25,-5.67; 25 0.25,-5.67; 26 0.75,-5.67; 27 1.25,-5.67; 28 1.75,-5.67; 29 2.25,-5.67; 30 2.75,-5.67; 31 3.25,-5.67; 32 3.75,-5.67; 49 3.75,5.67; 50 3.25,5.67; 51 2.75,5.67; 52 2.25,5.67; 53 1.75,5.67; 54 1.25,5.67; 55 0.75,5.67; 56 0.25,5.67; 57 -0.25,5.67; 58 -0.75,5.67; 59 -1.25,5.67; 60 -1.75,5.67; 61 -2.25,5.67; 62 -2.75,5.67; 63 -3.25,5.67; 64 -3.75,5.67
SOT23-3 = smd 0.8 x 0.9: 1 -0.95,-1; 2 0.95,-1; 3 0,1.1
TO252 = smd 1 x 1.6: 1 -2.28,-4.8; 2 2.28,-4.8 | smd 5.4 x 6.2: 3 0,2.5
R0603 = smd 1 x 1.1: 1 -0.85,0; 2 0.85,0
R0805 = smd 1.3 x 1.5: 1 -0.95,0; 2 0.95,0
TACTILE_SWITCH_PTH_6.0MM = drill 1.016 pad 1.88: 1 -3.251,2.261; 2 3.251,2.261; 3 -3.251,-2.261; 4 3.251,-2.261
39-30-?08? = drill 2 pad 3.5 square: 1 6.287,0 | drill 2 pad 3.5 octagon: 2 2.095,0; 3 -2.095,0; 4 -6.287,0; 5 6.287,5.512; 6 2.095,5.512; 7 -2.095,5.512; 8 -6.287,5.512 | hole 3: -6.287,-7.3; 6.287,-7.3
PWP_16 = smd 1.6 x 0.3: 1 -2.8,2.275; 2 -2.8,1.625; 3 -2.8,0.975; 4 -2.8,0.325; 5 -2.8,-0.325; 6 -2.8,-0.975; 7 -2.8,-1.625; 8 -2.8,-2.275; 9 2.8,-2.275; 10 2.8,-1.625; 11 2.8,-0.975; 12 2.8,-0.325; 13 2.8,0.325; 14 2.8,0.975; 15 2.8,1.625; 16 2.8,2.275 | smd 3 x 3: EPAD 0,0
5530843-6-BOARDFINGERS = smd 1.651 x 6.35 bottom: 1 0.826,3.375; 2 3.365,3.375; 3 5.905,3.375; 4 8.445,3.375; 5 10.986,3.375; 6 13.525,3.375; 7 16.066,3.375; 8 18.605,3.375; 9 21.145,3.375; 10 23.686,3.375; 11 26.226,3.375; 12 28.765,3.375; 13 31.305,3.375; 14 33.846,3.375; 15 36.386,3.375; 16 38.925,3.375; 17 41.465,3.375; 18 44.005,3.375; 19 46.545,3.375; 20 49.086,3.375; 21 51.626,3.375; 22 54.166,3.375; 23 56.706,3.375; 24 59.245,3.375; 25 61.785,3.375; 26 64.326,3.375; 27 66.865,3.375; 28 69.406,3.375 | smd 1.651 x 6.35: 29 69.406,3.375; 30 66.865,3.375; 31 64.326,3.375; 32 61.785,3.375; 33 59.245,3.375; 34 56.706,3.375; 35 54.166,3.375; 36 51.626,3.375; 37 49.086,3.375; 38 46.545,3.375; 39 44.005,3.375; 40 41.465,3.375; 41 38.925,3.375; 42 36.386,3.375; 43 33.846,3.375; 44 31.305,3.375; 45 28.765,3.375; 46 26.226,3.375; 47 23.686,3.375; 48 21.145,3.375; 49 18.605,3.375; 50 16.066,3.375; 51 13.525,3.375; 52 10.986,3.375; 53 8.445,3.375; 54 5.905,3.375; 55 3.365,3.375; 56 0.826,3.375
RESM8060X320N = smd 4.11 x 2.5: 1 -2.495,0; 2 2.495,0
TMR6-2415 = drill 0.7 square: P$1 0,0; P$2 2.54,0; P$3 5.08,0; P$5 10.16,0; P$6 12.7,0; P$7 15.24,0; P$8 17.78,0
RP2040 = smd 3.2 x 3.2: GND 0,0 | smd 1 x 0.2: P$1 -3.5,2.6; P$2 -3.5,2.2; P$3 -3.5,1.8; P$4 -3.5,1.4; P$5 -3.5,1; P$6 -3.5,0.6; P$7 -3.5,0.2; P$8 -3.5,-0.2; P$9 -3.5,-0.6; P$10 -3.5,-1; P$11 -3.5,-1.4; P$12 -3.5,-1.8; P$13 -3.5,-2.2; P$14 -3.5,-2.6; P$29 3.5,-2.6; P$30 3.5,-2.2; P$31 3.5,-1.8; P$32 3.5,-1.4; P$33 3.5,-1; P$34 3.5,-0.6; P$35 3.5,-0.2; P$36 3.5,0.2; P$37 3.5,0.6; P$38 3.5,1; P$39 3.5,1.4; P$40 3.5,1.8; P$41 3.5,2.2; P$42 3.5,2.6 | smd 0.2 x 1: P$15 -2.6,-3.5; P$16 -2.2,-3.5; P$17 -1.8,-3.5; P$18 -1.4,-3.5; P$19 -1,-3.5; P$20 -0.6,-3.5; P$21 -0.2,-3.5; P$22 0.2,-3.5; P$23 0.6,-3.5; P$24 1,-3.5; P$25 1.4,-3.5; P$26 1.8,-3.5; P$27 2.2,-3.5; P$28 2.6,-3.5; P$43 2.6,3.5; P$44 2.2,3.5; P$45 1.8,3.5; P$46 1.4,3.5; P$47 1,3.5; P$48 0.6,3.5; P$49 0.2,3.5; P$50 -0.2,3.5; P$51 -0.6,3.5; P$52 -1,3.5; P$53 -1.4,3.5; P$54 -1.8,3.5; P$55 -2.2,3.5; P$56 -2.6,3.5
USB-MINIB = smd 2.5 x 0.5: D+ 2.5,0; D- 2.5,0.8; GND 2.5,-1.6; ID 2.5,-0.8; VBUS 2.5,1.6 | smd 2.5 x 2: S1 -3,4.5; S2 2.5,4.5; S3 -3,-4.5; S4 2.5,-4.5 | hole 0.9: 0,2.2; 0,-2.2
VREG_LM1117IMPX-3.3/NOPB = smd 2.15 x 0.95: 1 -2.9,2.3; 2 -2.9,0; 3 -2.9,-2.3 | smd 2.15 x 3.25: 4 2.9,0
HC49US = drill 0.7 pad 1.651: 1 -2.54,0; 2 2.54,0
CRYSTAL-SMD-3.2X1.5MM = smd 1 x 1.8: P$1 -1.25,0; P$2 1.25,0

### Placement (x,y rotation side)
120  32.46,25.33 180 top
ARMED  35.81,29.66 270 top
C1  48.3,66.9 0 bottom
C2  59.49,60.13 270 top
C3  59.45,64.47 90 top
C4  72.88,49.43 0 top
C5  40.85,25.67 90 top
C6  48.3,64.4 0 bottom
C7  43.07,70.17 0 top
C8  38.62,59.84 0 top
C9  59.51,60.14 270 bottom
C10  51.4,68 90 bottom
C11  54.5,66.7 180 bottom
C12  54.4,64.3 180 bottom
C13  59.45,64.46 90 bottom
C14  52.7,84.8 180 top
C15  48,84.7 180 top
C16  56.41,39.43 0 top
C17  56.41,42 0 top
C18  56.41,44.31 180 top
C19  54.65,29.82 270 top
C20  72.88,22.65 0 top
CHARGING  10.95,91.31 90 top
CLAW_CONTROL  39-30-06?  [39-30-?06?]  16.18,28.36 270 top
D2  28.76,88.51 180 top
D3  28.74,71.68 180 top
D4  28.76,75.82 180 top
D5  28.75,80.08 180 top
D6  28.76,92.71 180 top
D7  28.76,84.32 180 top
D8  45.4,37.36 0 top
D9  45.4,41.57 0 top
D10  32.53,32.93 0 top
DISCHARGING  10.95,93.96 90 top
JTAG_HEADER  3.27,48.53 0 top
LIGHT1  67.7,89.6 0 top
LIGHT2  64.9,89.6 0 top
LIGHT3  62.2,89.6 0 top
LIGHT4  59.2,89.6 0 top
LIGHT5  56.3,89.6 0 top
LIGHT6  53.4,89.6 0 top
LIGHT7  50.4,89.6 0 top
LIGHT8  47.4,89.6 0 top
MARKER_DROPPER  39-30-04?  [39-30-?04?]  16.26,41.2 270 top
MC1  8.22,-11.33 0 top  (outside the outline)
POWER_INPUT  39-30-04?  [39-30-?04?]  16.1,15.53 270 top
Q1  30.4,86.7 0 bottom
Q2  40.11,46.12 0 top
Q3  35.74,46.14 0 top
Q4  30.4,78.87 0 bottom
Q5  30.4,71.39 0 bottom
Q6  25.71,57.19 90 top
Q7  27,78.9 0 bottom
Q8  27,82.6 0 bottom
Q9  27,71.4 0 bottom
Q10  30.4,75.2 0 bottom
Q11  30.4,90.5 0 bottom
Q12  51.54,41.68 180 top
Q13  27,75.21 0 bottom
Q14  30.4,82.61 0 bottom
Q15  27,90.5 0 bottom
Q16  27,86.7 0 bottom
Q17  51.54,37.74 180 top
Q18  25.7,65.49 90 top
R1  14.43,63.84 0 top
R2  14.43,58.92 180 top
R3  48.44,51.58 270 top
R4  48.51,47.02 90 top
R9  34.12,54.64 180 top
R11  14.43,61.38 0 top
R12  38.52,52.85 180 top
R13  14.43,66.3 0 top
R14  6.64,91.31 0 top
R17  6.64,93.96 0 top
R18  67.65,92.88 270 top
R19  64.9,92.88 270 top
R20  32.22,29.67 180 top
R22  62.24,92.88 270 top
R23  59.18,92.88 270 top
R24  56.33,92.88 270 top
R25  53.37,92.88 270 top
R26  50.42,92.88 270 top
R27  62.45,46.5 90 top
R28  47.35,92.88 270 top
R30  62.46,42.68 270 top
R43  34.07,63.14 180 top
R44  38.65,56.64 180 top
RESET_SWITCH  61.6,51.51 180 top
TORPEDO_CONNECTOR  39-30-08?  [39-30-?08?]  15.99,79.45 270 top
U1  53.43,49.27 0 top
U$1  15.76,0.05 0 top
U$2  40.9,87.9 180 top
U$3  38.2,91.8 0 bottom
U$4  38.2,76.3 0 bottom
U$5  40.9,75.1 180 top
U$6  27.86,18.66 0 top
U$7  38.2,83.9 0 bottom
U$8  40.9,80 180 top
U$9  4.03,-25.69 0 top  (outside the outline)
USB_ID/USB_DP/USB_DN  8.1,63.84 0 top
VR1  50.1,80 180 top
Y1  63.05,62.08 90 top
Y3  61.66,62.08 90 bottom

### Tracks (layer width: path | path; a pad name or v marks a point on that pad's centre or on a via)
+3V3  (via drill 0.35)  (8 unrouted)
  Top 0.152: 13.58,58.64 R2.2 | U$1.43 49.61,3.44 | C15.1 50.2,83.35 50.2,80.97 51.17,80 VR1.2 53.9,80 54.4,79.5 54.4,76.3 v50.2,72.1 | v19.06,7.65 20.54,7.65
  Top 0.35: v45.6,50.7 46.3,51.4 46.3,58.88 45.61,59.57 45.61,60.87 | v29,46.9 27.4,45.3 22,45.3 21.47,45.83 12.67,45.83 | 12.67,45.83 11.67,46.83 4.97,46.83 JTAG_HEADER.1 JTAG_HEADER.2 | JTAG_HEADER.2 10.1,57.9 13.15,57.9 13.58,58.64 | v19.06,7.65 18.56,7.65 14.09,12.11 14.09,44.41 12.67,45.83 | 49.61,3.44 49.61,7.55 47.87,9.3 v45.5,9.3 | 55.2,59.12 55.2,58.1 56.18,57.12 60.49,57.12 62.45,55.16 R27.2 | 20.54,7.65 22.65,7.65 24.3,9.3 v43.4,9.3 | 47.73,69.37 v48.3,68.8 | JTAG_HEADER.2 3.27,82.87 CHARGING.A
  Bottom 0.152: v50.2,72.1 50.2,70.3 48.7,68.8 v48.3,68.8
  Bottom 0.35: v45.6,50.7 43.6,48.7 30.8,48.7 v29,46.9 | v45.5,9.3 v43.4,9.3
  pour Bottom (no thermals): 15.93,7.67 16.57,8.3 21.65,8.3 22.28,7.67 22.28,1.95 15.93,1.95
  pour Top (no thermals): 15.93,7.67 16.57,8.3 21.65,8.3 22.28,7.67 22.28,1.95 15.93,1.95
  pour Bottom (rank 2, no thermals): 48.3,67.3 48.3,62.4 49.3,61.4 53.6,61.4 54.5,62.3 54.5,67.1 55.8,68.4 55.8,69.2 55.4,69.6 54.1,69.6 52.5,68 50.5,68 48.9,69.6 47.6,69.6 47.3,69.3 47.3,68.3
+5V  (via drill 0.35, 0.77, 0.9)
  Top 0.775: R3.2 47.95,50.73 45.9,48.68 v45.9,47.52
  Top 0.8: U$1.12 44.42,3.52 44.42,20.63 43.2,21.86 D8.C D9.C 42.07,42.7 v41.09,42.7 | U1.2 50.61,50.91 49.67,50.91 49.49,50.73 | R3.2 49.49,50.73 | 49.49,50.73 49.26,50.5 49.26,49.34 49.64,48.96 50.61,48.96 U1.5 U1.6
  Bottom 0.775: v41.09,42.7 45.9,47.5 v45.9,47.52 | v45.9,47.52
  Bottom 0.8: MARKER_DROPPER.2 MARKER_DROPPER.4 24.94,40.13 38.53,40.13 v41.09,42.7
  other vias: 44.56,7.65
  pour Top (no thermals): 41.2,1.83 41.2,7.67 41.84,8.3 47.17,8.3 47.81,7.67 47.81,1.83
  pour Bottom (no thermals): 41.2,1.83 41.2,7.67 41.84,8.3 47.17,8.3 47.81,7.67 47.81,1.83
+12V
  Top 0.8: POWER_INPUT.2 19.09,20.62 19.09,25.85 16.58,28.36 CLAW_CONTROL.2
+24V  (via drill 2)
  Top 1.5: 30.5,71.72 30.98,71.72 D3.C | 30.94,75.8 D4.C | 30.96,80.07 D5.C | D7.C | DISCHARGING.A 23.42,93.96
  Top 1.905: 30.5,32.15 31.27,31.38 R20.2 27.46,25.86 120.P$2 27.46,24.86
  Top 2: 30.5,71.72 Q18.2 30.5,66.97 33.22,64.25 R43.2 33.22,62.18 Q6.2 30.51,58.2 33.27,55.44 R9.2 33.27,53.64 30.5,50.87 D10.C 30.5,32.15 | D3.C 30.94,75.8 | D4.C 30.96,80.07 | D5.C D7.C | D7.C D2.C D6.C 28.41,95.27 24.72,95.27 23.42,93.96 | v57.03,20.79 56.97,20.85 47.32,20.85 v46.13,22.04 | v31.2,22.1 30.22,22.1 27.46,24.86
  Bottom 2: v46.13,22.04 46.07,22.1 v31.2,22.1 | v57.03,20.79 71.01,20.79 C20.1 C4.1 | C4.1
AGND  (via drill 0.35, 0.45, 0.5, 0.77, 0.8, 1.3, 1.5)  (70 unrouted)
  Top 0.152: R18.1 R19.1 R22.1 R23.1 R24.1 R25.1 R26.1 R28.1 47.32,93.8 v45.5,93.8 | 57.15,66.57 59.16,66.57 v59.43,66.3 59.43,65.35 C3.2 | C8.1 37.73,59.8 v36.4,59.8 | v43,71.3 42.22,70.52 C7.1 | Q3.2 37.84,45.14 v37.9,45.2 | Q2.2 41.06,45.06 v40.3,44.3 | 40.85,28.85 v40.9,28.9 | ARMED.C 37.57,29.66 v37.59,29.64 | 36.17,32.93 v36.2,32.9 | C2.2 58.02,59.28 v58,59.3 | C15.2 47.15,83.05 v47.1,83 | R3.1 50.05,52.43 v50.06,52.44 | R4.1 v50.18,46.07 v50.19,46.06 | C16.2 57.29,39.4 v57.29,37.58 | C19.2 v54.65,24.63 | U1.13 55.9,49.27 U1.EPAD 53.1,49.59 U1.4 | R30.2 v62.46,40.53 v62.47,40.52
  Top 0.35: R14.1 v3.61,91.31 v3.6,91.3
  Top 0.4: USB_ID/USB_DP/USB_DN.GND 7.9,59.53 v7.9,59.3
  Top 0.406: USB_ID/USB_DP/USB_DN.S1 7.76,68.34 | 7.76,68.34 v7.8,68.3 | USB_ID/USB_DP/USB_DN.S2 7.76,68.34 | USB_ID/USB_DP/USB_DN.S3 7.86,59.34 v7.9,59.3 10.57,59.3 USB_ID/USB_DP/USB_DN.S4
  Top 0.775: U1.EPAD v53.43,51.51 | v53.43,51.51
  Top 0.8: Q17.2 49.66,38.74 v49.2,39.2 | C5.2 40.85,28.85 | D10.A 36.17,32.93 | Q12.2 49.82,42.68 v49.3,43.2 | C14.2 50.7,84.8 v50.3,85.2 | VR1.1 52.4,77.1 v52.4,75.7
  Top 1.3: R17.1 3.64,93.96 v3.6,94
  Top 1.5: U$2.1 44.5,89 v44.5,90.8 | U$8.1 44.5,81.11 v44.5,82.7 | U$5.1 46.2,75.1 v46.8,75.7
  other vias: 26.73,7.67 37.01,7.67
  pour Top (no thermals): 23.55,7.67 24.19,8.3 29.27,8.3 29.9,7.67 29.9,1.95 23.55,1.95
  pour Bottom (no thermals): 23.55,7.67 24.19,8.3 29.27,8.3 29.9,7.67 29.9,1.95 23.55,1.95
  pour Top (no thermals): 33.71,1.83 40.19,1.83 40.19,7.67 39.68,8.3 34.09,8.3 33.58,7.67 33.58,1.95
  pour Bottom (no thermals): 33.58,7.67 33.58,1.95 33.71,1.83 40.06,1.83 40.06,5.76 40.19,5.89 40.19,7.67 39.68,8.3 34.09,8.3
  pour Bottom (rank 3, no thermals): 0.25,101.35 101.35,101.35 101.35,8.13 48.01,8.13 47.5,8.64 41.66,8.64 40.89,7.87 40.39,7.87 39.62,7.11 24.13,7.11 23.37,7.87 22.61,7.87 21.84,8.64 16.26,8.64 15.75,8.13 0.25,8.13
ARM_TORPEDO
  Top 0.152: 45.77,65.54 44.84,65.54 43.94,64.64 43.94,48.24 42.05,46.35 42.05,44.45 41.2,43.6 33.2,43.6 32.39,42.79 32.39,28.56 32.94,28.02 U$6.P$3
COIL_1  (via drill 1.5)
  Top 1.5: D5.A 22.96,80.08 TORPEDO_CONNECTOR.7 | v35.1,80 U$8.2
  Bottom 1.5: TORPEDO_CONNECTOR.7 23.04,80 Q7.3 27.03,79.97 Q4.3 35.07,79.97 v35.1,80
COIL_1_GATE  (via drill 0.35)
  Top 0.152: v42.7,66.59 42.7,66.61 42.01,67.3 36,67.3 32.8,70.5 32.8,77.45 v32.45,77.8 | v53.5,60.4 53.73,60.17
  Bottom 0.152: v42.7,66.59 v42.71,66.59 48.9,60.4 v53.5,60.4 | Q7.1 28.85,78.8 30.42,78.8 Q4.1 32.38,77.87 v32.45,77.8
COIL_2
  Top 1.5: D7.A 25.96,83.72 23.51,83.72 TORPEDO_CONNECTOR.8
  Bottom 1.5: TORPEDO_CONNECTOR.8 23.53,83.7 Q8.3 Q14.3 30.51,83.82 35.63,83.82 U$7.2
COIL_2_GATE  (via drill 0.35)
  Top 0.152: v42.7,67.5 42.49,67.7 36.1,67.7 33.1,70.7 33.1,81.05 v32.55,81.6 | v54.4,60.4 54.4,60.1 54.23,59.93
  Bottom 0.152: v54.4,60.4 54.4,60.7 54.1,61 49.2,61 v42.7,67.5 | Q8.1 28.75,82.4 30.56,82.4 Q14.1 v32.55,81.6
COIL_3  (via drill 1.5)
  Top 1.5: D3.A 25.74,72.48 22.18,72.48 TORPEDO_CONNECTOR.5 | U$5.2 38.41,75 v35.9,72.5
  Bottom 1.5: TORPEDO_CONNECTOR.5 22.16,72.5 Q9.3 Q5.3 | Q5.3 | Q5.3 v35.9,72.5
COIL_3_GATE  (via drill 0.35)
  Top 0.152: 49.19,70.52 49.19,71.36 48.35,72.2 42.33,72.2 39.33,69.2 37.1,69.2 v36.4,69.9
  Bottom 0.152: Q9.1 28.85,71.3 30.44,71.3 Q5.1 35.91,70.39 v36.4,69.9
COIL_4
  Top 1.5: D4.A 26.06,76.32 22.53,76.32 TORPEDO_CONNECTOR.6
  Bottom 1.5: TORPEDO_CONNECTOR.6 22.54,76.31 Q13.3 Q10.3 U$4.2
COIL_4_GATE  (via drill 0.35)
  Top 0.152: 48.69,70.52 48.69,71.26 48.07,71.88 42.58,71.88 39.6,68.9 36.4,68.9 34.3,71 v34.3,73.8
  Bottom 0.152: Q13.1 28.94,75.2 30.35,75.2 Q10.1 33.9,74.2 v34.3,73.8
COIL_5
  Top 1.5: D6.A 25.44,91.6 16.3,91.6 13.1,88.4 13.1,84.4 15.96,81.54 TORPEDO_CONNECTOR.3
  Bottom 1.5: TORPEDO_CONNECTOR.3 15.97,81.54 13.04,84.48 13.04,88.29 16.35,91.6 Q15.3 Q11.3 30.5,91.7 35.6,91.7 U$3.2
COIL_5_GATE  (via drill 0.35)
  Top 0.152: 36.23,68.57 33.7,71.1 33.7,88.45 v32.65,89.5
  Bottom 0.152: Q15.1 28.85,90.4 30.45,90.4 Q11.1 v32.65,89.5
COIL_S  (via drill 1.5)
  Top 1.5: D2.A 25.85,87.8 25,87.8 23.2,89.6 19.85,89.6 TORPEDO_CONNECTOR.4 | v35.1,87.8 38.3,87.8 U$2.2
  Bottom 1.5: TORPEDO_CONNECTOR.4 19.84,89.58 23.15,89.58 24.94,87.8 Q16.3 Q1.3 v35.1,87.8
COIL_S_GATE  (via drill 0.35)
  Top 0.152: 45.78,68.1 36.2,68.1 33.4,70.9 33.4,84.85 v32.65,85.6
  Bottom 0.152: Q16.1 28.85,86.6 30.45,86.6 Q1.1 31.45,85.6 v32.65,85.6
DROPPER1  (via drill 0.8)
  Top 0.8: Q17.3 51.54,36.54 51.4,36.4 49.9,36.4 48.94,37.36 D8.A 47.56,37.4 45.7,37.4 v45.5,37.2
  Bottom 0.8: v45.5,37.2 44.97,37.2 44.08,38.09 23.49,38.09 22.52,37.11 18.25,37.11 MARKER_DROPPER.1
DROPPER1_GATE  (via drill 0.35)
  Top 0.152: 45.77,67.54 44.54,67.54 41.7,64.7 v41.7,58 | v44.5,55.2 44.5,47.1 47.66,43.94 50.67,43.94 51.62,42.98 51.62,41.98 52.49,41.11 Q17.1
  Bottom 0.152: v44.5,55.2 v41.7,58
DROPPER2  (via drill 0.8)
  Top 0.8: Q12.3 49.72,40.58 48.73,41.57 D9.A 45.5,39.47 v45.5,38.8
  Bottom 0.8: v45.5,38.8 44.74,38.8 44.43,39.11 MARKER_DROPPER.3
DROPPER2_GATE  (via drill 0.35)
  Top 0.152: 45.77,67.04 44.55,67.04 42.3,64.79 v42.3,58.7 | v45.1,55.9 v45.09,55.9 45.09,47.1 47.86,44.34 50.84,44.34 Q12.1
  Bottom 0.152: v45.1,55.9 v42.3,58.7
EXTRA1  (via drill 0.35)
  Top 0.152: v60.15,7.9 | v60.15,7.9 59.46,8.59 59.46,54.63 59.14,54.95 53.65,54.95 50.48,58.12 49.37,58.12 49.23,58.25
  Bottom 0.152: U$1.28 85.16,5.14 83,7.3 60.75,7.3 v60.15,7.9
EXTRA5
  Top 0.152: 51.26,59.12 51.26,58.48 54.12,55.62 59.68,55.62 60.3,55.01 60.3,9.35 62.35,7.3 66.8,7.3 67.38,6.72 U$1.36
EXTRA6  (via drill 0.35)
  Top 0.152: U$1.35 69.92,6.96 69.28,7.6 63.04,7.6 v62.74,7.9 | v61,7.9 59.9,9 59.9,54.81 59.4,55.31 53.87,55.31 50.73,58.45
  Bottom 0.152: v61,7.9 v62.74,7.9
LED1
  Top 0.152: LIGHT1.A 66.03,87.18 58.65,87.18 58.33,86.85 58.33,75.89 53.73,71.29
LED2
  Top 0.152: LIGHT2.A 63.73,87.68 58.2,87.68 57.83,87.31 57.83,75.89 53.23,71.29
LED3
  Top 0.152: LIGHT3.A 61.53,88.18 57.84,88.18 57.33,87.66 57.33,75.79 52.73,71.19
LED4
  Top 0.152: LIGHT4.A 57.8,88.85 56.83,87.88 56.83,75.79 52.23,71.19
LED5
  Top 0.152: LIGHT5.A 56.33,88.82 56.33,75.79 51.73,71.19
LED6
  Top 0.152: LIGHT6.A 54.07,88.18 54.97,88.18 55.83,87.32 55.83,75.79 51.23,71.19
LED7
  Top 0.152: LIGHT7.A 51.47,87.78 54.62,87.78 55.33,87.07 55.33,75.89 50.73,71.29
LED8
  Top 0.152: LIGHT8.A 48.97,87.28 54.37,87.28 54.83,86.82 54.83,75.99 50.23,71.39
N$2
  Top 0.152: 57.11,63.54 56.58,63.54 55.98,62.94 55.98,61 56.48,60.5 57.91,60.5 58.39,60.98 C2.1 61.61,60.98 Y1.1
N$3
  Top 0.152: Y1.2 62.04,63.62 C3.1 58.91,63.07
N$4
  Top 0.35: CHARGING.C R14.2
N$5  (via drill 0.35)
  Top 0.152: 45.74,61.64 45.34,61.64 44.91,61.2 v44.91,60.1 | v41,59.8 39.52,59.8 C8.2
  Bottom 0.152: v44.91,60.1 44.6,59.8 v41,59.8
N$6
  Top 0.152: USB_ID/USB_DP/USB_DN.ID 11.92,63.04
  Top 0.35: 11.92,63.04 R11.1
N$7
  Top 0.152: USB_ID/USB_DP/USB_DN.D+ R1.1
N$8
  Top 0.152: USB_ID/USB_DP/USB_DN.D- 11.92,64.64 R13.1
N$10
  Top 0.152: R20.1 ARMED.A
N$11
  Top 0.152: C7.2 45.22,71.47 47.94,71.47 48.23,71.19
N$12  (via drill 0.35)
  Top 0.152: v59.1,62.3 58.9,62.5 57.22,62.5
  Bottom 0.152: Y3.P$2 59.72,63.33 C13.1 59.45,62.48 59.27,62.3 v59.1,62.3
N$15
  Top 1.3: R17.2 DISCHARGING.C
N$16
  Top 0.152: R18.2 67.7,91.89 LIGHT1.C
N$17
  Top 0.152: R19.2 LIGHT2.C
N$18
  Top 0.152: R22.2 62.2,91.89 LIGHT3.C
N$19
  Top 0.152: R23.2 59.2,91.92 LIGHT4.C
N$21
  Top 0.152: R24.2 56.3,91.91 LIGHT5.C
N$22
  Top 0.152: R25.2 53.4,91.91 LIGHT6.C
N$23
  Top 0.152: R26.2 50.4,91.92 LIGHT7.C
N$24
  Top 0.152: R28.2 47.4,91.89 LIGHT8.C
N$26
  Top 1.5: C5.1 41.36,23.66
  Top 2: 41.36,23.66 41.36,19.46 U$6.P$6 | 120.P$1 39.69,25.33 C5.1
N$29  (via drill 0.35)
  Top 0.152: v60,62.3 59.81,62.3 59.31,61.8 58.39,61.8 58.09,62.1 57.18,62.1
  Bottom 0.152: Y3.P$1 59.67,60.83 C9.1 60.21,61.69 60.21,62.09 v60,62.3
N$30
  Top 0.152: 53.26,59.12 53.26,58.23 54.79,56.7 60.22,56.7 61.61,55.3 61.61,44.37 R30.1
N$33  (via drill 0.35)
  Top 0.152: v30.8,64.4 30.8,64.31 30.5,64.01 Q18.1 | v34.7,64.5 34.92,64.28 R43.1 34.92,58.82 37.1,56.64 R44.2
  Bottom 0.152: v34.7,64.5 30.9,64.5 v30.8,64.4
N$34
  Top 0.152: R44.1 39.5,55.15 40.7,53.95 40.7,47.81 Q2.3
N$35  (via drill 0.35)
  Top 0.152: R12.2 37.66,52.84 36.77,52.84 R9.1 34.97,55.93 v34.8,56.1 | v30.6,56 30.5,55.9 Q6.1
  Bottom 0.152: v34.8,56.1 30.7,56.1 v30.6,56
N$36
  Top 0.152: R12.1 40.17,52.05 40.17,48.67 38.74,47.24 Q3.3
N$45
  Top 0.152: U1.8 50.32,47.3 49.84,47.3 49.17,47.97 R4.2
N$46
  Top 0.152: U1.14 56.72,50.23 57.22,49.73 57.22,48.81 58.12,47.91 58.12,43.66 57.27,42.8 C17.2
N$47
  Top 0.152: U1.9 55.71,46.99 54.67,45.95 54.67,43.63 55.56,42.74 C17.1 C16.1 55.65,39.34 55.65,34.92 54.65,33.92 C19.1
N$48
  Top 0.152: U1.11 56.97,48.29 57.22,48.04 57.22,46.85 55.49,45.13 55.49,44.38 C18.2
N$49
  Top 0.152: U1.12 56.72,48.93 57.46,48.19 57.46,46.6 57.27,46.41 C18.1
PWM_CLAW  (via drill 0.35)
  Top 0.152: v45.6,49.8 45.61,49.8 46.71,50.89 46.71,59.51 47.3,60.1 50.99,60.1 53.39,62.51 54.3,62.51 56.1,64.3 56.1,67.26 56.38,67.54 57.11,67.54 | v29,46 29,31.43 21.74,24.17 CLAW_CONTROL.4
  Bottom 0.152: v29,46 31.33,48.33 44.13,48.33 v45.6,49.8
PWM_DRIVER1  (via drill 0.35)
  Top 0.152: 58.14,68.07 v58.5,67.71 | v52.3,52.24 51.62,51.55 51.62,50.75 51.11,50.24 U1.3
  Bottom 0.152: v58.5,67.71 58.5,66.55 58.26,66.31 58.26,59.75 58.51,59.51 58.51,57.91 | v52.3,52.24 53.06,52.24 53.26,52.44 53.26,52.67 58.51,57.91 | 58.51,57.91
PWM_DRIVER2  (via drill 0.35)
  Top 0.152: v58.5,68.57 v58.51,68.56 | v54.55,52.27 55.5,52.27 U1.16
  Bottom 0.152: v58.51,68.56 58.52,68.56 59.01,68.08 59.01,66.71 58.56,66.26 58.56,59.91 58.74,59.73 58.74,57.78 53.59,52.63 53.59,52.4 53.72,52.27 v54.55,52.27
PWM_OUT1  (via drill 0.35)
  Top 0.152: U1.7 50.77,47.5 52.97,47.5 53.28,47.18 53.28,36.81 v46.62,30.15
  Bottom 0.152: v46.62,30.15 46.35,30.15 46.15,30.34 23.64,30.34 21.69,28.4 CLAW_CONTROL.5
PWM_OUT2  (via drill 0.35)
  Top 0.152: U1.10 56.08,47.5 53.92,47.5 53.59,47.16 53.59,36.72 48.21,31.35 48.21,30.94 v47.98,30.71
  Bottom 0.152: CLAW_CONTROL.6 21.76,32.55 23.63,30.68 47.95,30.68 v47.98,30.71
RESET  (via drill 0.35)
  Top 0.152: JTAG_HEADER.15 22.88,46.7 26.1,46.7 v29,49.6 | 57.11,64.04 56.38,64.04 55.6,63.26 55.6,58.6 v56.3,57.9 60.73,57.9 RESET_SWITCH.3 64.86,52.39 63.37,50.9 63.37,46.56 R27.1
  Bottom 0.152: v29,49.6 v29.01,49.61 41.9,49.61 50.2,57.91 v56.3,57.91 v56.3,57.9
SCL  (via drill 0.35)
  Top 0.152: U$1.31 80.08,7.82 78.86,9.04 63.1,9.04 v63.09,9.05 | v61.39,9.05 60.7,9.73 60.7,55.23 59.98,55.96 54.33,55.96 52.23,58.05
  Bottom 0.152: v61.39,9.05 61.4,9.06 63.07,9.06 v63.09,9.05
SDA
  Top 0.152: U$1.32 77.54,7.66 76.66,8.54 62.7,8.54 61.14,10.09 61.14,55.32 60.13,56.33 54.57,56.33 52.73,58.17
SWD_CLK  (via drill 0.35)
  Top 0.152: v29,48.7 26.56,46.26 22.5,46.26 22.03,46.73 15.23,46.73 JTAG_HEADER.9 | v47.25,54.2 47.25,58.67
  Bottom 0.152: v29,48.7 29.64,49.34 42.34,49.34 47.2,54.2 v47.25,54.2
SWD_IO  (via drill 0.35)
  Top 0.152: 45.77,62.04 45.04,62.04 44.4,61.4 44.4,59.6 45.7,58.3 45.7,51.7 v45.6,51.6 | v29,47.8 27,45.8 22.22,45.8 21.69,46.33 14.89,46.33 14.49,46.73 12.69,46.73 JTAG_HEADER.7
  Bottom 0.152: v45.6,51.6 43.07,49.07 30.27,49.07 v29,47.8
TORPEDO1
  Top 1.5: TORPEDO_CONNECTOR.1 23.2,65.94 Q18.3
TORPEDO1_GATE
  Top 0.152: 45.77,66.54 44.64,66.54 42.95,64.85 42.95,48.91 Q2.1
TORPEDO2
  Top 1.5: TORPEDO_CONNECTOR.2 14.77,78.57 12.84,76.64 12.84,71.47 18.1,66.2 18.1,62.36 23.21,57.25 Q6.3
TORPEDO2_GATE
  Top 0.152: 45.77,66.04 44.74,66.04 43.44,64.74 43.44,48.62 40.19,45.36 40.19,44.92 39.52,44.25 35.69,44.25 Q3.1
USB_DN  (via drill 0.35)
  Top 0.152: 45.78,63.1 44.7,63.1 v44.5,63.3 | R13.2 15.6,66.3 v16.6,65.3
  Bottom 0.152: v44.5,63.3 18.6,63.3 v16.6,65.3
USB_DP  (via drill 0.35)
  Top 0.152: v44.5,62.4 45.64,62.4 | R1.2 16.56,63.84 v16.6,63.8
  Bottom 0.152: v44.5,62.4 44,62.9 18,62.9 17.1,63.8 v16.6,63.8
USB_ID
  Top 0.35: R11.2 R2.1
V+
  Top 1.5: U$6.P$2 28.66,16.93 22.31,16.93 POWER_INPUT.4
VBUS  (via drill 0.9)
  Top 0.8: USB_ID/USB_DP/USB_DN.VBUS 13.4,68.23 v13.4,68.3 | v51.2,81.6 52.3,81.6 VR1.3 53,84.25 C14.1
  Bottom 0.8: v13.4,68.3 13.86,68.76 43.36,68.76 50.3,75.7 50.3,80.7 v51.2,81.6
VDD  (3 unrouted)
VSS  (1 unrouted)

### Text on the board
tPlace: Illustrated By: Isabella Richardson, 2021 | The Underwater Robotics Team / Center for Automotive Research | Actuator Board
tNames: Microcontroller Debug